# Altium project SC941C.PrjPcb (part 1 of 2)
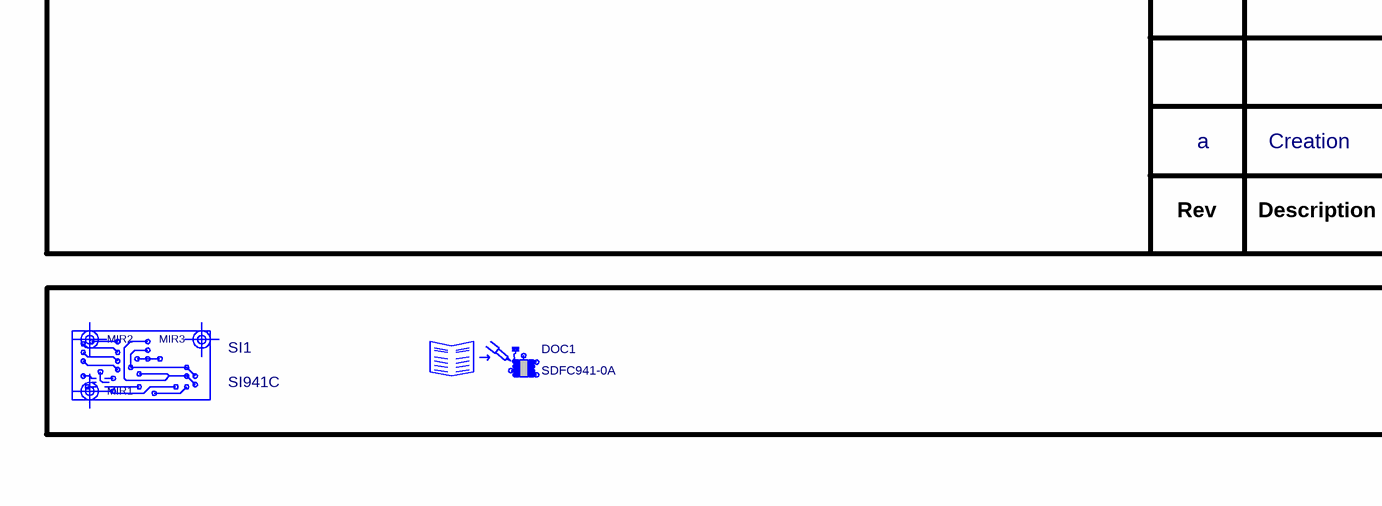
[diagram p0: SC941C_Sommaire.SchDoc, left]
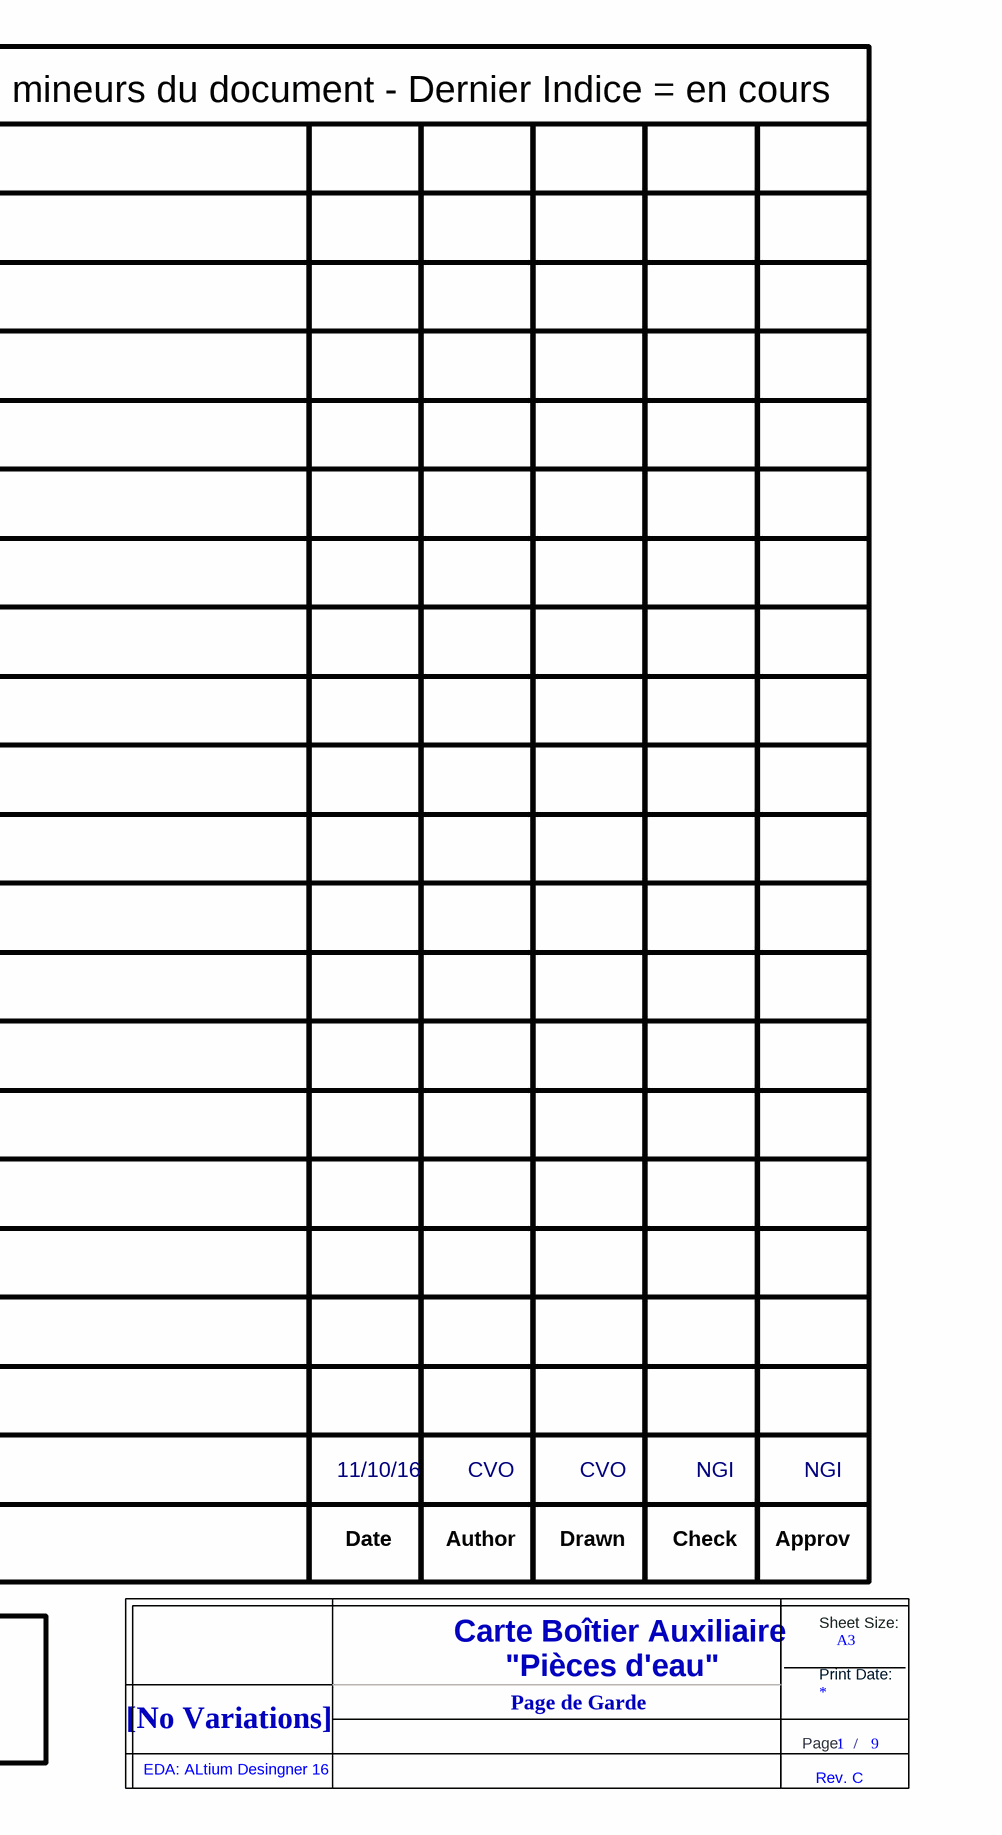
[diagram p1: SC941C_Sommaire.SchDoc, right]
_Instructions_SC: Les dates et versions mineurs du SDEC (SC) sont � remplir sur la page ..._infos.doc; _Instructions_SI: Les dates et versions mineurs du SI sont � remplir dans la couche "Cartouche TOP"; prjPcbTitle0: Carte Bo�tier Auxiliaire; prjPcbTitle1: "Pi�ces d'eau"; refSI1: SI941C; SDECSheetSize: A3; SISheetSize: A3
9 sheets, 334 parts. Net scope: global (net labels, ports and power ports of the same name join across sheets).
Board file: SI941C.PcbDoc
Sheets:
  SC941C_Sommaire.SchDoc
  SC941C_Coeur.SchDoc
  SC941C_ETOR1.SchDoc
  SC941C_ETOR2.SchDoc
  SC941C_STORRM1.SchDoc
  SC941C_STORRM2.SchDoc
  SC941C_Variateurs.SchDoc
  SC941C_STORRB.SchDoc
  SC941C_Borniers.SchDoc

## Sheet SC941C_Sommaire.SchDoc: Page de Garde
size 393 x 270 mm; CompanyName: Seccom; Address1: 521, rue du capt. François Garbit; Address2: 69440 Mornant; Address3: seccom@seccom.fr; Address4: www.seccom.fr; DocumentNumber: 1; SheetNumber: 1; SheetTotal: 9; PageSetup: Record=PageOptions|CenterHorizontal=True|CenterVertical=True|PrintScale=0.74|XCorrection=1.00|YCorrection=1.00|PrintKind=0|BorderSize=5000000|LeftOffset=0|BottomOffset=0|Orientation=2|PaperLength=1000|PaperWidth=1000|Scale=100|PaperSource=7|PrintQuality=-4|MediaType=1|DitherType=10|PaperKind=A4|PrintScaleMode=1

### Parts
(Parts that share a designator on the sheet are numbered #1, #2 ... from top to bottom, then left to right.)
DOC1  Reference: SDFC941-0A  (hidden comment: DOCUMENT_FAB_CARTE_SDFC)  (mechanical)
MIR1  MIRE_PICK-N-PLACE  [MIRE_PICK-N-PLACE_D1MM_VE3MM]  (value not drawn)
MIR2  MIRE_PICK-N-PLACE  [MIRE_PICK-N-PLACE_D1MM_VE3MM]  (value not drawn)
MIR3  MIRE_PICK-N-PLACE  [MIRE_PICK-N-PLACE_D1MM_VE3MM]  (value not drawn)
SI1  Reference: SI941C  [CIRCUIT_IMPRIME_SI_STD]
Title_new#1  DNI  (value not drawn)  (graphical)

### Notes on the sheet
- Historique des indices mineurs du document - Dernier Indice = en cours
- a
- Creation
- 11/10/16
- CVO
- NGI
- Rev
- Description
- Date
- Author
- Drawn
- Check
- Approv
- Page de Garde
- (in symbol Title_new) Sheet Size:; Carte Boîtier Auxiliaire; A3; "Pièces d'eau"; Print Date:; [No Variations]; Page:; /; EDA: ALtium Desingner 16; Rev. C

### Library data of the parts
DOC1 = DOCUMENT_FAB_CARTE_SDFC: Document de Fabrication pour la Carte SC{Num SC}-{Version SC}; Creation: LJ; Coeff: 0; Verification: *; Boitier: *; Fabricant: *; Ref Fab: *; Config: *; ComponentLink1URL: http://192.168.0.202/index.php/Accueil; ComponentLink2URL: http://192.168.0.202/index.php/Accueil; ComponentLink1Description: Datasheet; ComponentLink2Description: Datasheet Boitier
MIR1-MIR3 = MIRE_PICK-N-PLACE: Mire pour machine de placement CMS "Pick'n Place"; Creation: LJ (25/10/12); Config: NC; Coeff: 0; Value: *
SI1 = CIRCUIT_IMPRIME_MODEL: Circuit Imprimé; Creation: LJ; Verification: LJ (15/11/04); Remarque: {Remarque}; Fabricant: Valentinéa; Coeff: 1; Value: *; Boitier: *; Ref Fab: SI941C; ComponentLink1URL: \\SRV_backup\datasheet\; ComponentLink2URL: \\SRV_backup\datasheet\_BOITIERS\; Config: *; ComponentLink1Description: Datasheet; ComponentLink2Description: Datasheet Boitier
Title_new#1 = Title_new

## Sheet SC941C_Coeur.SchDoc: Coeur
size 393 x 270 mm; CompanyName: Seccom; Address1: 521, rue du capt. François Garbit; Address2: 69440 Mornant; Address3: seccom@seccom.fr; Address4: www.seccom.fr; DocumentNumber: 2; SheetNumber: 2; SheetTotal: 9; PageSetup: Record=PageOptions|CenterHorizontal=True|CenterVertical=True|PrintScale=0.74|XCorrection=1.00|YCorrection=1.00|PrintKind=0|BorderSize=5000000|LeftOffset=0|BottomOffset=0|Orientation=2|PaperLength=1000|PaperWidth=1000|Scale=100|PaperSource=7|PrintQuality=-4|MediaType=1|DitherType=10|PaperKind=A4|PrintScaleMode=1
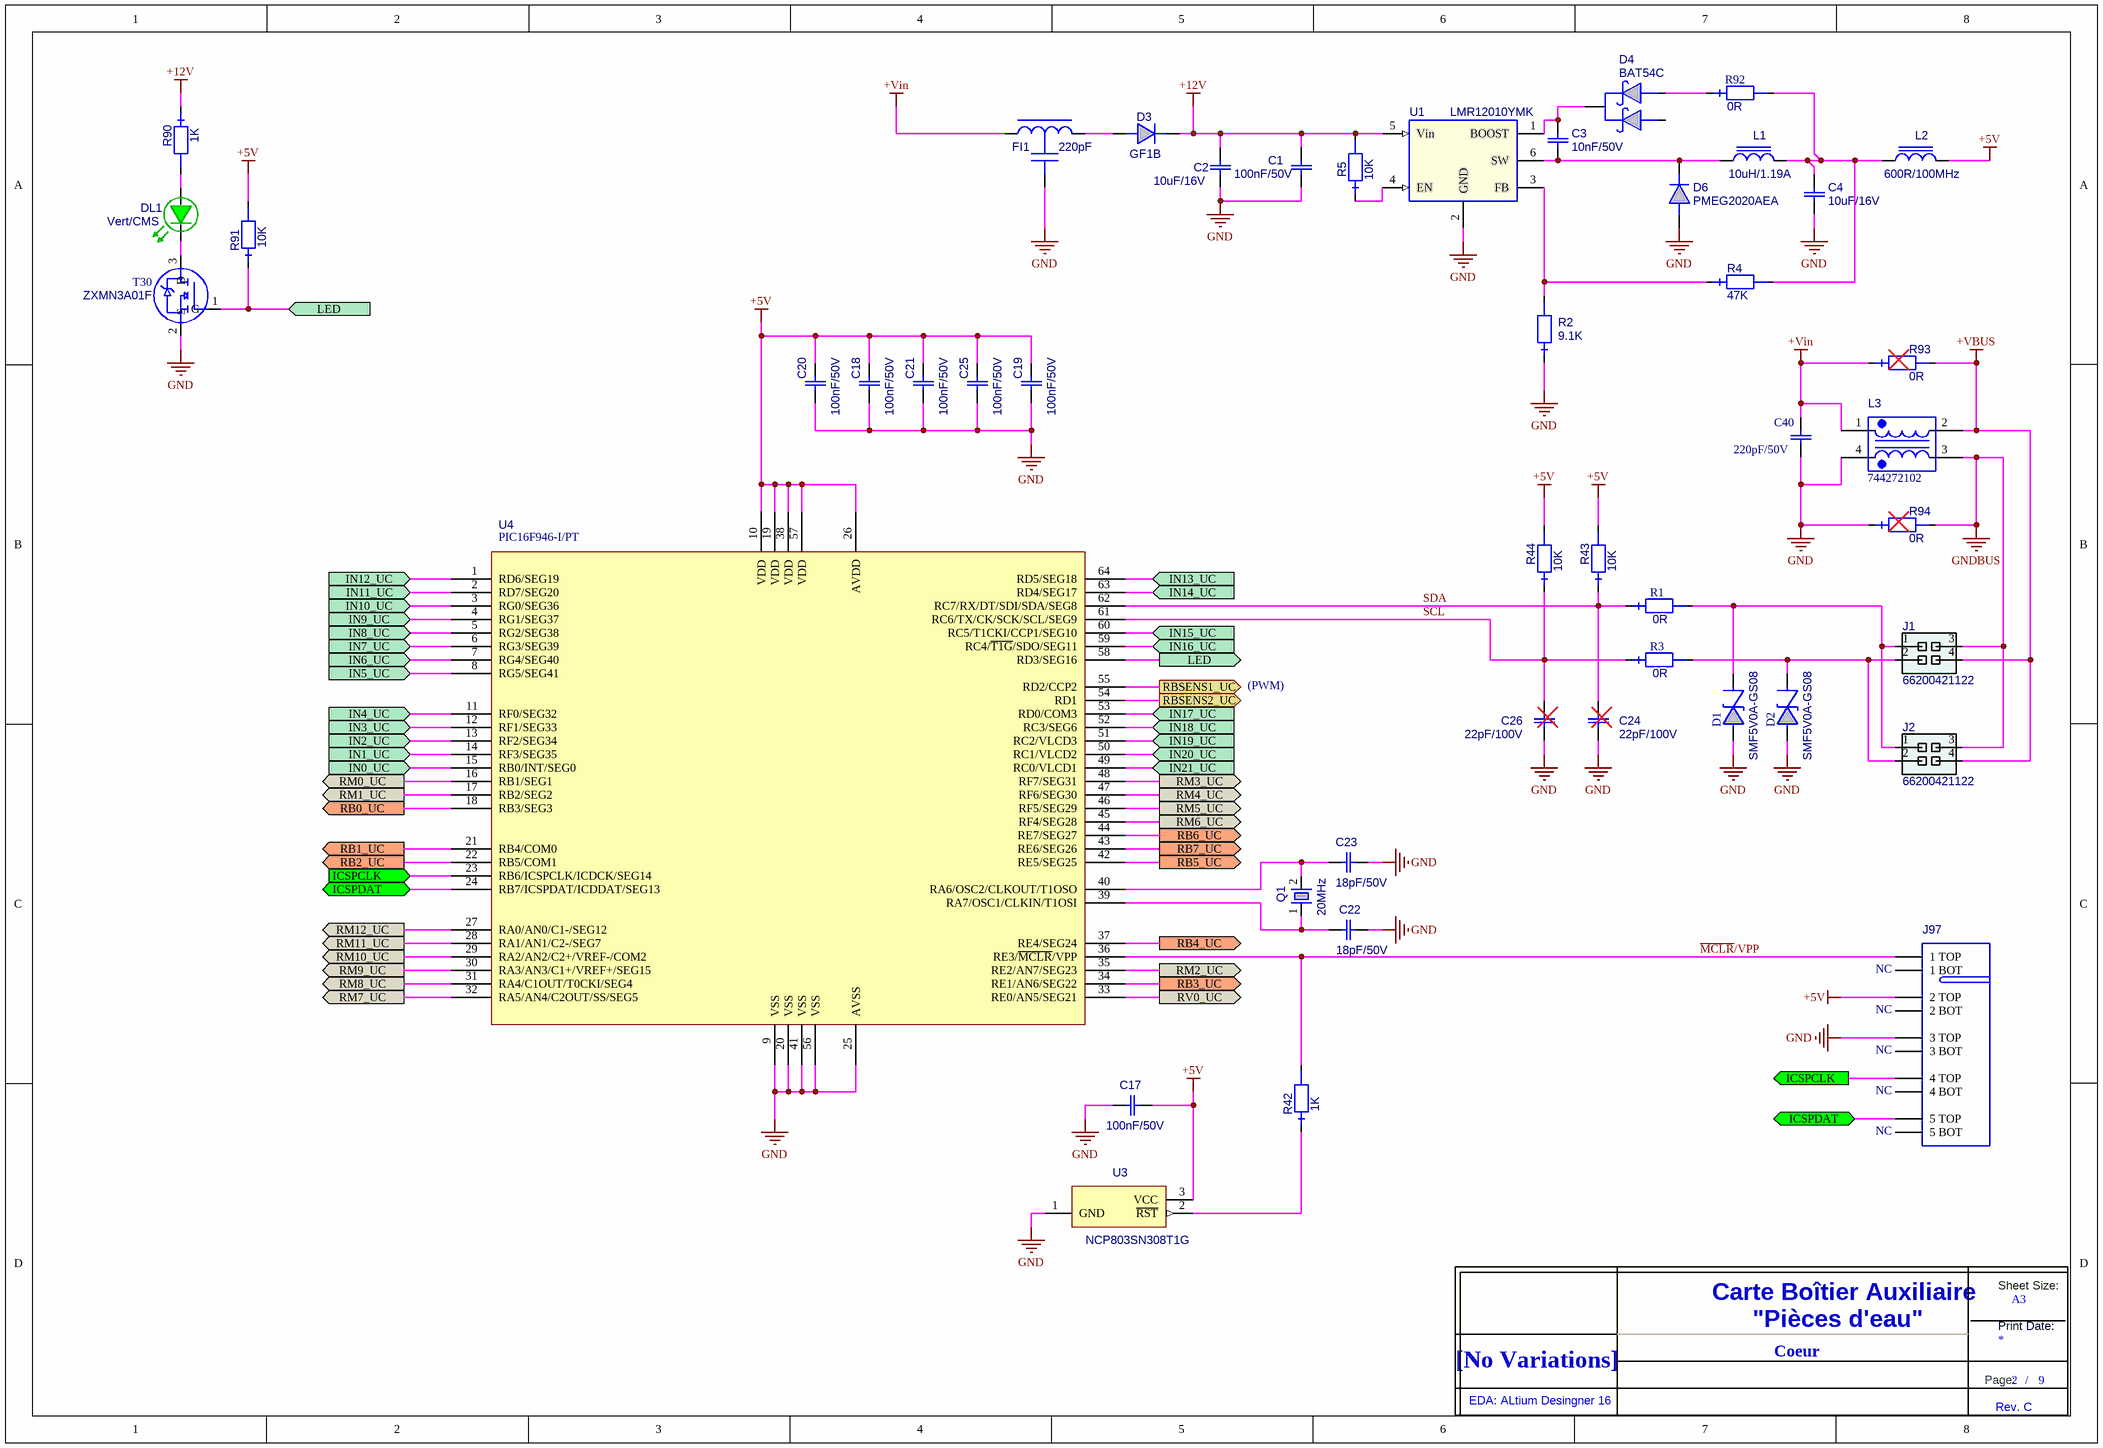
[diagram p2: SC941C_Coeur.SchDoc]

### Parts
(Parts that share a designator on the sheet are numbered #1, #2 ... from top to bottom, then left to right.)
C1  value 100nF/50V  [0805_ReflowSoldering_CAP]  (hidden comment: C_0805_X7R_10%_100N-50V)
C2  value 10uF/16V  [0805_ReflowSoldering_CAP]  (hidden comment: C_0805_X5R_10%_10U-16V)
C3  value 10nF/50V  [0603_ReflowSoldering_CAP]  (hidden comment: C_0603_X7R_10%_10N-50V)
C4  value 10uF/16V  [0805_ReflowSoldering_CAP]  (hidden comment: C_0805_X5R_10%_10U-16V)
C17  value 100nF/50V  [0805_ReflowSoldering_CAP]  (hidden comment: C_0805_X7R_10%_100N-50V)
C18  value 100nF/50V  [0805_ReflowSoldering_CAP]  (hidden comment: C_0805_X7R_10%_100N-50V)
C19  value 100nF/50V  [0805_ReflowSoldering_CAP]  (hidden comment: C_0805_X7R_10%_100N-50V)
C20  value 100nF/50V  [0805_ReflowSoldering_CAP]  (hidden comment: C_0805_X7R_10%_100N-50V)
C21  value 100nF/50V  [0805_ReflowSoldering_CAP]  (hidden comment: C_0805_X7R_10%_100N-50V)
C22  value 18pF/50V  [0603_ReflowSoldering_CAP]  (hidden comment: C_0603_NPO_5%_18P-50V)
C23  value 18pF/50V  [0603_ReflowSoldering_CAP]  (hidden comment: C_0603_NPO_5%_18P-50V)
C24  value 22pF/100V  [0805_ReflowSoldering_CAP]  (hidden comment: C_0805_NPO_5%_22P-100V)  (no BOM)
C25  value 100nF/50V  [0805_ReflowSoldering_CAP]  (hidden comment: C_0805_X7R_10%_100N-50V)
C26  value 22pF/100V  [0805_ReflowSoldering_CAP]  (hidden comment: C_0805_NPO_5%_22P-100V)  (no BOM)
C40  Capacitance: 220pF/50V  [0603_ReflowSoldering_CAP]  (hidden comment: C_0603_NPO_5%_220pF-50V)
D1  SMF5V0A-GS08  [DO219AB-SMF-P_ReflowSoldering]
D2  SMF5V0A-GS08  [DO219AB-SMF-P_ReflowSoldering]
D3  GF1B  [DO214BA-P]
D4  BAT54C  [SOT23_3L_ReflowSoldering]
D6  PMEG2020AEA  [SOD323_ReflowSoldering]
DL1  value Vert/CMS  [LED_0805_KPx_Green]  (hidden comment: LED_0805_VERT_KP2012)
FI1  value 220pF  [NFE31P]  (hidden comment: EMIFIL_220P_25V/6A_NFE31PT221D1E9L)
J1  value 66200421122  [MICRO-MATE-N-LOK_WURTH+TYCO_2X02_D]  (hidden comment: MICRO-MATE-N-LOK_WURTH_2X02_D)
J2  value 66200421122  [MICRO-MATE-N-LOK_WURTH+TYCO_2X02_D]  (hidden comment: MICRO-MATE-N-LOK_WURTH_2X02_D)
J97  EMB_ZEC_1893711_HOTE  [EMB_ZEC_1893711_HOTE_NOBOTT]  (value not drawn)  (no BOM)
L1  value 10uH/1.19A  [SELF_WE-TPC_4.8x4.78_(type4828)]  (hidden comment: SELF_10UH_1.19A_744043100)
L2  value 600R/100MHz  [1206_ReflowSoldering_FERRITE]  (hidden comment: IND_FERRITE_1206_74279218)
L3  744272102  [744272102]
Q1  value 20MHz  [QUARTZ_HC49_11.5X5_CMS]  (hidden comment: QUARTZ_HC49/4HSMX_20M)
R1  value 0R  [0805_ReflowSoldering_RES]  (hidden comment: RES_0805_1%_100PPM_0R)
R2  value 9.1K  [0805_ReflowSoldering_RES]  (hidden comment: RES_0805_1%_100PPM_9.1K)
R3  value 0R  [0805_ReflowSoldering_RES]  (hidden comment: RES_0805_1%_100PPM_0R)
R4  value 47K  [0805_ReflowSoldering_RES]  (hidden comment: RES_0805_1%_100PPM_47K)
R5  value 10K  [0805_ReflowSoldering_RES]  (hidden comment: RES_0805_1%_100PPM_10K)
R42  value 1K  [0805_ReflowSoldering_RES]  (hidden comment: RES_0805_1%_100PPM_1K)
R43  value 10K  [0805_ReflowSoldering_RES]  (hidden comment: RES_0805_1%_100PPM_10K)
R44  value 10K  [0805_ReflowSoldering_RES]  (hidden comment: RES_0805_1%_100PPM_10K)
R90  value 1K  [0805_ReflowSoldering_RES]  (hidden comment: RES_0805_1%_100PPM_1K)
R91  value 10K  [0805_ReflowSoldering_RES]  (hidden comment: RES_0805_1%_100PPM_10K)
R92  value 0R  [0805_ReflowSoldering_RES]  (hidden comment: RES_0805_1%_100PPM_0R)
R93  value 0R  [0603_ReflowSoldering_RES]  (hidden comment: RES_0603_1%_100PPM_0R)  (no BOM)
R94  value 0R  [0603_ReflowSoldering_RES]  (hidden comment: RES_0603_1%_100PPM_0R)  (no BOM)
T30  ZXMN3A01F  [SOT23_3L_ReflowSoldering]
Title_new#2  DNI  (value not drawn)  (graphical)
U1  LMR12010YMK  [SOT23_6L]
U3  NCP803SN308T1G  [SOT23_3L_ReflowSoldering]
U4  PIC16F946-I/PT  [QFP_064_E0,50_10X10MM]

### Ports
ICSPCLK (in), ICSPCLK (out), ICSPDAT (bidir), IN0_UC (in), IN1_UC (in), IN2_UC (in), IN3_UC (in), IN4_UC (in), IN5_UC (in), IN6_UC (in), IN7_UC (in), IN8_UC (in), IN9_UC (in), IN10_UC (in), IN11_UC (in), IN12_UC (in), IN13_UC (in), IN14_UC (in), IN15_UC (in), IN16_UC (in), IN17_UC (in), IN18_UC (in), IN19_UC (in), IN20_UC (in), IN21_UC (in), LED (in), LED (out), RB0_UC (out), RB1_UC (out), RB2_UC (out), RB3_UC (out), RB4_UC (out), RB5_UC (out), RB6_UC (out), RB7_UC (out), RBSENS1_UC (out), RBSENS2_UC (out), RM0_UC (out), RM1_UC (out), RM2_UC (out), RM3_UC (out), RM4_UC (out), RM5_UC (out), RM6_UC (out), RM7_UC (out), RM8_UC (out), RM9_UC (out), RM10_UC (out), RM11_UC (out), RM12_UC (out), RV0_UC (out)

### Nets
+5V: C17.1 C18.2 C19.2 C20.2 C21.2 C25.2 J97.2(2_TOP) L2.2 R43.2 R44.2 R91.2 U3.3(VCC) U4.10(VDD) U4.19(VDD) U4.26(AVDD) U4.38(VDD) U4.57(VDD)
+12V: C1.1 C2.2 D3.K R5.2 R90.1 U1.5(Vin)
+VBUS: J1.4 J2.4 L3.2 R93.2
+Vin: C40.2 FI1.1 L3.1 R93.1
GND: C1.2 C2.1 C4.1 C17.2 C18.1 C19.1 C20.1 C21.1 C22.1 C23.1 C24.1 C25.1 C26.1 C40.1 D1.A D2.A D6.A FI1.2 J97.3(3_TOP) L3.4 R2.1 R94.1 T30.2(S) U1.2(GND) U3.1(GND) U4.9(VSS) U4.20(VSS) U4.25(AVSS) U4.41(VSS) U4.56(VSS)
GNDBUS: J1.3 J2.3 L3.3 R94.2
~{MCLR}/VPP: J97.1(1_TOP) R42.2 U4.36(RE3/~{MCLR}/VPP)
ICSPCLK: J97.4(4_TOP) U4.23(RB6/ICSPCLK/ICDCK/SEG14) ; port ICSPCLK
ICSPDAT: J97.5(5_TOP) U4.24(RB7/ICSPDAT/ICDDAT/SEG13) ; port ICSPDAT
IN0_UC: U4.15(RB0/INT/SEG0) ; port IN0_UC
IN1_UC: U4.14(RF3/SEG35) ; port IN1_UC
IN2_UC: U4.13(RF2/SEG34) ; port IN2_UC
IN3_UC: U4.12(RF1/SEG33) ; port IN3_UC
IN4_UC: U4.11(RF0/SEG32) ; port IN4_UC
IN5_UC: U4.8(RG5/SEG41) ; port IN5_UC
IN6_UC: U4.7(RG4/SEG40) ; port IN6_UC
IN7_UC: U4.6(RG3/SEG39) ; port IN7_UC
IN8_UC: U4.5(RG2/SEG38) ; port IN8_UC
IN9_UC: U4.4(RG1/SEG37) ; port IN9_UC
IN10_UC: U4.3(RG0/SEG36) ; port IN10_UC
IN11_UC: U4.2(RD7/SEG20) ; port IN11_UC
IN12_UC: U4.1(RD6/SEG19) ; port IN12_UC
IN13_UC: U4.64(RD5/SEG18) ; port IN13_UC
IN14_UC: U4.63(RD4/SEG17) ; port IN14_UC
IN15_UC: U4.60(RC5/T1CKI/CCP1/SEG10) ; port IN15_UC
IN16_UC: U4.59(RC4/~{T1G}/SDO/SEG11) ; port IN16_UC
IN17_UC: U4.53(RD0/COM3) ; port IN17_UC
IN18_UC: U4.52(RC3/SEG6) ; port IN18_UC
IN19_UC: U4.51(RC2/VLCD3) ; port IN19_UC
IN20_UC: U4.50(RC1/VLCD2) ; port IN20_UC
IN21_UC: U4.49(RC0/VLCD1) ; port IN21_UC
LED: R91.1 T30.1(G) U4.58(RD3/SEG16) ; port LED
RB0_UC: U4.18(RB3/SEG3) ; port RB0_UC
RB1_UC: U4.21(RB4/COM0) ; port RB1_UC
RB2_UC: U4.22(RB5/COM1) ; port RB2_UC
RB3_UC: U4.34(RE1/AN6/SEG22) ; port RB3_UC
RB4_UC: U4.37(RE4/SEG24) ; port RB4_UC
RB5_UC: U4.42(RE5/SEG25) ; port RB5_UC
RB6_UC: U4.44(RE7/SEG27) ; port RB6_UC
RB7_UC: U4.43(RE6/SEG26) ; port RB7_UC
RBSENS1_UC: U4.55(RD2/CCP2) ; port RBSENS1_UC
RBSENS2_UC: U4.54(RD1) ; port RBSENS2_UC
RM0_UC: U4.16(RB1/SEG1) ; port RM0_UC
RM1_UC: U4.17(RB2/SEG2) ; port RM1_UC
RM2_UC: U4.35(RE2/AN7/SEG23) ; port RM2_UC
RM3_UC: U4.48(RF7/SEG31) ; port RM3_UC
RM4_UC: U4.47(RF6/SEG30) ; port RM4_UC
RM5_UC: U4.46(RF5/SEG29) ; port RM5_UC
RM6_UC: U4.45(RF4/SEG28) ; port RM6_UC
RM7_UC: U4.32(RA5/AN4/C2OUT/SS/SEG5) ; port RM7_UC
RM8_UC: U4.31(RA4/C1OUT/T0CKI/SEG4) ; port RM8_UC
RM9_UC: U4.30(RA3/AN3/C1+/VREF+/SEG15) ; port RM9_UC
RM10_UC: U4.29(RA2/AN2/C2+/VREF-/COM2) ; port RM10_UC
RM11_UC: U4.28(RA1/AN1/C2-/SEG7) ; port RM11_UC
RM12_UC: U4.27(RA0/AN0/C1-/SEG12) ; port RM12_UC
RV0_UC: U4.33(RE0/AN5/SEG21) ; port RV0_UC
SCL: C26.2 R3.1 R44.1 U4.61(RC6/TX/CK/SCK/SCL/SEG9)
SDA: C24.2 R1.1 R43.1 U4.62(RC7/RX/DT/SDI/SDA/SEG8)
NetC3_1: C3.1 D6.K L1.1 U1.6(SW)
NetC3_2: C3.2 D4.3 U1.1(BOOST)
NetC4_2: C4.2 L1.2 L2.1 R4.2 R92.2
NetC22_2: C22.2 Q1.1 U4.39(RA7/OSC1/CLKIN/T1OSI)
NetC23_2: C23.2 Q1.2 U4.40(RA6/OSC2/CLKOUT/T1OSO)
NetD1_K: D1.K J1.1 J2.1 R1.2
NetD2_K: D2.K J1.2 J2.2 R3.2
NetD3_A: D3.A FI1.3
NetD4_1: D4.1 R92.1
NetDL1_A: DL1.A R90.2
NetDL1_K: DL1.K T30.3(D)
NetR2_2: R2.2 R4.1 U1.3(FB)
NetR5_1: R5.1 U1.4(EN)
NetR42_1: R42.1 U3.2(~{RST})

Not connected (* = marked no-connect by the designer): D4 2; J97 6(1_BOT) 7(2_BOT) 8(3_BOT) 9(4_BOT) 10(5_BOT); L1 3 4 5 6

### Notes on the sheet
- (PWM)
- (near J97) NC
- Coeur
- (in symbol Title_new) Sheet Size:; Carte Boîtier Auxiliaire; A3; "Pièces d'eau"; Print Date:; [No Variations]; Page:; /; EDA: ALtium Desingner 16; Rev. C

### Library data of the parts
C1 C17-C21 C25 = C_0805_X7R_10%_100N-50V: Condensateur céramique, X7R, 10%, CMS 0805; Creation: LJ; Verification: LJ (28/05/04); Reference: 000042/00; Boitier: 0805; Remarque: {Remarque}; Fabricant: AVX; Ref Fab: 08055C104KAT2A; Coeff: 1; ComponentLink1URL: o:\_Documentation\Datasheets\BC_Components\Condo_CMS_NPO-X7R-Y5V.pdf; ComponentLink2URL: o:\_Documentation\Datasheets\_BOITIERS\PASSIF_CMS\RC_0805_(2x1,25)_(Schneider).PDF; Config: *; ComponentLink1Description: Datasheet; ComponentLink2Description: Datasheet Boitier; Supplier 1: Farnell; Supplier Part Number 1: 499687
C2 C4 = C_0805_X5R_10%_10U-16V: Condensateur céramique, X5R, 10%, CMS 0805; Creation: LJ (12/09/11); Reference: 001715/00; Boitier: 0805; Remarque: {Remarque}; Coeff: 1; Fabricant: Murata; Ref Fab: GRM219R61C106KA73D; Verification: *; ComponentLink1URL: o:\_Documentation\Datasheets\; ComponentLink2URL: o:\_Documentation\Datasheets\_Boitiers\PASSIF_CMS\RC_0805_(2x1,25)_(Schneider).pdf; Config: *; ComponentLink1Description: Datasheet; ComponentLink2Description: Datasheet Boitier
C3 = C_0603_X7R_10%_10N-50V: Condensateur céramique, X7R, 10%, CMS 0603; Creation: CHD; Boitier: 0603; Remarque: {Remarque}; Coeff: 1; Fabricant: Kemet; Ref Fab: C0603C103K5RAC; ComponentLink1URL: o:\_Documentation\Datasheets\Kemet\Condos_Ceramic_CMS.pdf; ComponentLink2URL: o:\_Documentation\Datasheets\_BOITIERS\PASSIF_CMS\; Config: *; ComponentLink1Description: Datasheet; ComponentLink2Description: Datasheet Boitier; Supplier 1: Farnell; Supplier Part Number 1: 1414609
C22 C23 = C_0603_NPO_5%_18P-50V: Condensateur céramique, NPO, 5%, CMS 0603, 18pF/50V; Creation: FB (04/07/12); Boitier: 0603; Remarque: {Remarque}; Fabricant: Kemet; Ref Fab: C0603C180J5GAC; Coeff: 1; ComponentLink2URL: o:\_Documentation\Datasheets\_BOITIERS\PASSIF_CMS\; Config: *; ComponentLink1Description: Datasheet; ComponentLink2Description: Datasheet Boitier; Supplier 1: Farnell; Supplier Part Number 1: 1414620
C24 C26 = C_0805_NPO_5%_22P-100V: Condensateur céramique, NPO, 5%, CMS 0805; Creation: LJ; Verification: LJ (28/05/04); Boitier: 0805; Remarque: {Remarque}; Fabricant: AVX; Ref Fab: 08051A220JAT2A; Coeff: 1; ComponentLink1URL: o:\_Documentation\Datasheets\BC_Components\Condo_CMS_NPO-X7R-Y5V.pdf; ComponentLink2URL: o:\_Documentation\Datasheets\_BOITIERS\PASSIF_CMS\RC_0805_(2x1,25)_(Schneider).PDF; Config: *; ComponentLink1Description: Datasheet; ComponentLink2Description: Datasheet Boitier; Supplier 1: Farnell; Supplier 2: Mouser; Supplier Part Number 1: 317500; Supplier Part Number 2: 581-08051A220J
C40 = C_0603_NPO_5%_220pF-50V: Multilayer Ceramic Capacitors MLCC - SMD/SMT 50volts 220pF C0G 5%; Manufacturer: Kemet; Manufacturer Part Number: C0603C221J5GACTU; Temperature Coefficient: C0G, NP0; Ref Fab: C0603C221J5GAC; Value: 220pF/50V; Value: 220pF/50V; Supplier 1: Digi-Key; RoHS: RoHS Compliant; Category: Capacitors; Stock 1: 173034; Pricing 1: 1=0.1, 10=0.042, 50=0.0228, 100=0.0193, 250=0.01576, 500=0.01348, 1000=0.0105 (USD); Packaging: Cut Tape (CT); Part Status: Active; Tolerance: ±5%; Operating Temperature: -55°C ~ 125°C; Features: Low ESL; Ratings: -; Applications: General Purpose; Failure Rate: -; Mounting Type: Surface Mount, MLCC; Package / Case: 0603 (1608 Metric); Size / Dimension: 0.063" L x 0.031" W (1.60mm x 0.80mm); Height - Seated (Max): -; Thickness (Max): 0.034" (0.87mm); Lead Spacing: -; Lead Style: -; ComponentLink1URL: http://www.kemet.com/docfinder?Partnumber=C0603C221J5GACTU; ComponentLink1Description: http://www.kemet.com/docfinder?Partnumber=C0603C221J5GACTU; Supplier Part Number 1: 399-1066-1-ND; Fabricant: Kemet
D1 D2 = SMF5V0A-GS08: Diode Transil/TVS unidirectionnelle (A), 200W, 5V, CMS; Creation: LJ; Boitier: DO219AB/SMF; Remarque: {Remarque}; Fabricant: Vishay; Coeff: 1; Verification: *; Ref Fab: SMF5V0A-GS08; ComponentLink1URL: o:\_Documentation\Datasheets\Vishay\SMF5V0A~51A.pdf; ComponentLink2URL: o:\_Documentation\Datasheets\_BOITIERS\; Config: *; ComponentLink1Description: Datasheet; ComponentLink2Description: Datasheet Boitier; Value: SMF5V0A-GS08; Supplier 1: Farnell; Supplier 2: Mouser; Supplier Part Number 1: 1617696; Supplier Part Number 2: 78-SMF5V0A
D3 = GF1B: Diode de Redressement, Vrrm=100V, If=1A, Vf=1.1V, CMS; Creation: LJ; Reference: 000919/00; Boitier: DO214BA; Fabricant: Fairchild; Coeff: 1; Ref Fab: GF1B; ComponentLink1URL: o:\_Documentation\Datasheets\Fairchild\GF1A-M.PDF; ComponentLink2URL: o:\_Documentation\Datasheets\_BOITIERS\ACTIF_CMS\; Config: *; ComponentLink1Description: Datasheet; ComponentLink2Description: Datasheet Boitier; Value: GF1B; Supplier 1: Farnell; Supplier 2: Mouser; Supplier Part Number 1: 1467477; Supplier Part Number 2: 512-GF1B
D4 = BAT54C: Diode Schottky double, BAT54 cathode com, Vrrm=30V, If=300mA, Vf=0.4Vmax, CMS; Creation: LJ (14/05/02); Reference: 000597/00; Boitier: SOT23_3L; Remarque: {Remarque}; Fabricant: NXP; Coeff: 1; Verification: LJ (14/05/02); Ref Fab: BAT54C; ComponentLink1URL: o:\_Documentation\Datasheets\NXP\BAT54_series.pdf; ComponentLink2URL: o:\_Documentation\Datasheets\_BOITIERS\ACTIF_CMS\SOT\SOT_23_3P_(Schneider).PDF; Config: *; ComponentLink1Description: Datasheet; ComponentLink2Description: Datasheet Boitier; Value: BAT54C; Supplier 1: Farnell; Supplier Part Number 1: 1081192
D6 = PMEG2020AEA: Diode Schottky, Vrrm=20V, If=2A, Vf=450V, CMS; Creation: PDP 10/07/12; Verification: LJ (02/08/12); Boitier: SOD323; Remarque: {Remarque}; Coeff: 1; Fabricant: NXP; ComponentLink1URL: o:\_Documentation\Datasheets\NXP\PMEG2020AEA.PDF; ComponentLink2URL: o:\_Documentation\Datasheets\_BOITIERS\ACTIF_CMS\SOD\SOD_80_(MLL34)_(Schneider).PDF; Config: *; ComponentLink1Description: Datasheet; ComponentLink2Description: Datasheet Boitier; Ref Fab: PMEG2020AEA; Value: PMEG2020AEA; Supplier 1: Farnell; Supplier Part Number 1: 8737940; Supplier 2: Mouser; Supplier Part Number 2: 771-PMEG2020AEA-T/R
DL1 = LED_0805_VERT_KP2012: LED CMS 0805, Vert, Vf 2.5V@20mA (4-15mCd), 525nm, vue 120°; Creation: LJ (12/01/09); Reference: 000037/00; Boitier: 0805; Remarque: {Remarque}; Fabricant: Kingbright; Ref Fab: KP-2012SGC; Coeff: 1; Verification: *; ComponentLink1URL: o:\_Documentation\Datasheets\Kingbright\Leds_0805_Green_KP-2012SGC.pdf; ComponentLink2URL: o:\_Documentation\Datasheets\Kingbright\Leds_0805_Green_KP-2012SGC.pdf; Config: *; ComponentLink1Description: Datasheet; ComponentLink2Description: Datasheet Boitier; Supplier 1: Farnell; Supplier Part Number 1: 1318243
FI1 = EMIFIL_220P_25V/6A_NFE31PT221D1E9L: Filtre EMI selfique-capacitif, -20/+50%, 25Vcc/6A, -40/+85°C, 220pF; Creation: LJ; Boitier: 1206; Remarque: Anciennement série NFM60R...; Reference: 000785/00; Fabricant: Murata; Coeff: 1; Verification: *; Ref Fab: NFE31PT221D1E9L; ComponentLink1URL: o:\_Documentation\Datasheets\Murata\EMIFIL_NFE31P.pdf; ComponentLink2URL: o:\_Documentation\Datasheets\_BOITIERS\; Config: *; ComponentLink1Description: Datasheet; ComponentLink2Description: Datasheet Boitier
J1 J2 = MICRO-MATE-N-LOK_WURTH_2X02_D: Embase type Micro Mate-n-Lok, e3mm, 4pts, droit, cont. étamés 20mR, 250V/5A, Iso 1500V, -40/+105°C; Creation: LJ (01/08/12); Boitier: Micro Mate-n-Lok 4 D; Remarque: {Remarque}; Fabricant: Wurth Elektronik; Coeff: 1; Ref Fab: 66200421122; ComponentLink1URL: o:\_Documentation\Datasheets\; ComponentLink2URL: o:\_Documentation\Datasheets\; Config: *; ComponentLink1Description: Datasheet; ComponentLink2Description: Datasheet Boitier
J97 = EMB_ZEC_1893711_HOTE: Implantation CI pour connecteur ZEC 1,0/5-ST-3,5 C1 R1,5 (ref 1893711); Creation: JPL (18/07/12); Fabricant: Phoenix Contact; Coeff: 1; Config: *; ComponentLink1Description: Datasheet; ComponentLink2Description: Datasheet Boitier
L1 = SELF_10UH_1.19A_744043100: Inductance bobinée CMS, 10uH +/- 10%, I=1.19A, Rdc=0.095R, SRF=40MHz, -40/+85°C; Creation: LJ (02/08/12); Boitier: 4.8x4.8_h2.8mm; Coeff: 1; Fabricant: Wurth Elektronik; Verification: *; ComponentLink1URL: O:\_Documentation\Datasheets\Wurth_Elektronik\744043100.pdf; ComponentLink2URL: O:\_Documentation\Datasheets\Wurth_Elektronik\744043100.pdf; Remarque: *; Config: *; ComponentLink1Description: Datasheet; ComponentLink2Description: Datasheet Boitier; Ref Fab: 744043100
L2 = IND_FERRITE_1206_74279218: Inductance à ferrite multicouches CMS, imp=600R@100MHz, +/-25%, Rdc=100mR, I=2A; Creation: LJ (12/08/08); Reference: 000049/00; Boitier: 1206; Remarque: Alternative aux selfs de choc; Coeff: 1; Fabricant: Wurth Elektronik; Verification: *; ComponentLink1URL: o:\_Documentation\Datasheets\Wurth_Elektronik\74279218.pdf; ComponentLink2URL: o:\_Documentation\Datasheets\_Boitiers\PASSIF_CMS\RC_1206_(3,2x1,6)_(Schneider).pdf; Config: *; ComponentLink1Description: Datasheet; ComponentLink2Description: Datasheet Boitier; Ref Fab: 74279218
L3 = IND_FERRITE_WE-SL5_2X1000UH: Common Mode Filters / Chokes WE-SL5 Bifilar 2x1000uH 950mA; Manufacturer: Wurth Electronics Inc; Filter Type: Signal Line; Number of Lines: 2; Impedance @ Frequency: 3.6 kOhm @ 100kHz; Inductance @ Frequency: 1mH @ 100kHz; DC Resistance (DCR) (Max): 180 mOhm; Voltage Rating - DC: 80V; Fabricant: Wurth Elektronik; Supplier 1: Digi-Key; Manufacturer Part Number: 744272102; RoHS: RoHS Compliant; Category: Filters; Stock 1: 4893; Pricing 1: 1=3.57, 10=3.255, 50=2.94, 100=2.835 (USD); Packaging: Cut Tape (CT); Part Status: Active; Current Rating (Max): 950mA; Voltage Rating - AC: -; Operating Temperature: -40°C ~ 125°C; Ratings: -; Approvals: -; Features: -; Mounting Type: Surface Mount; Size / Dimension: 0.394" L x 0.343" W (10.00mm x 8.70mm); Height (Max): 0.256" (6.50mm); Package / Case: Horizontal, 4 PC Pad; ComponentLink1URL: http://katalog.we-online.de/pbs/datasheet/744272102.pdf; ComponentLink1Description: http://katalog.we-online.de/pbs/datasheet/744272102.pdf; Supplier Part Number 1: 732-1493-1-ND; Ref Fab: 744272102; Value: 744272102
Q1 = QUARTZ_HC49/4HSMX_20M: Quartz CMS série HCM49 (équiv HC49/US), -10/+60°C, +/-30ppm, 18pF; Creation: FB (04/09/12); Fabricant: Citizen; Ref Fab: HCM49 20.000MABJ-UT; Coeff: 1; Verification: *; Boitier: HC49/4HSMX; Remarque: *; ComponentLink1URL: O:\_Documentation\Datasheets\Citizen\Quartz_HC49-US_HCM49.pdf; ComponentLink2URL: o:\_Documentation\Datasheets\_BOITIERS\; Config: *; ComponentLink1Description: Datasheet; ComponentLink2Description: Datasheet Boitier; Supplier 1: Farnell; Supplier Part Number 1: 1611736; Supplier 2: Mouser; Supplier Part Number 2: 695-HCM49-20-U
R1 R3 R92 = RES_0805_1%_100PPM_0R: Résistance CMS 0805, 0.125W, 1%, 100ppm, 150V; Creation: LJ (06/02/09); Reference: 000052/00; Boitier: 0805; Remarque: {Remarque}; Fabricant: Welwyn; Ref Fab: WCR0805-R005JI; Coeff: 1; Verification: *; ComponentLink1URL: o:\_Documentation\Datasheets\Welwyn\Resistances_CMS_General.pdf; ComponentLink2URL: o:\_Documentation\Datasheets\_BOITIERS\PASSIF_CMS\RC_0805_(2x1,25)_(Schneider).PDF; Config: *; ComponentLink1Description: Datasheet; ComponentLink2Description: Datasheet Boitier; Supplier 1: Farnell; Supplier Part Number 1: 1099786
R2 = RES_0805_1%_100PPM_9.1K: Résistance CMS 0805, 0.125W, 1%, 100ppm, 150V; Creation: LJ (06/02/09); Reference: 000144/00; Boitier: 0805; Remarque: {Remarque}; Coeff: 1; Fabricant: Yageo; Ref Fab: RC0805FR-079K1L; Verification: *; ComponentLink1URL: o:\_Documentation\Datasheets\BC_Components\Resistances_ThickFilmFlatChip_0402-0603-0805-1206.pdf; ComponentLink2URL: o:\_Documentation\Datasheets\_BOITIERS\PASSIF_CMS\RC_0805_(2x1,25)_(Schneider).PDF; Config: *; ComponentLink1Description: Datasheet; ComponentLink2Description: Datasheet Boitier; Supplier 1: Mouser; Supplier Part Number 1: 603-RC0805FR-079K1L
R4 = RES_0805_1%_100PPM_47K: Résistance CMS 0805, 0.125W, 1%, 100ppm, 150V; Creation: LJ (06/02/09); Reference: 000141/00; Boitier: 0805; Remarque: {Remarque}; Coeff: 1; Fabricant: Yageo; Ref Fab: C0805FR-0747KL; Verification: *; ComponentLink1URL: o:\_Documentation\Datasheets\BC_Components\Resistances_ThickFilmFlatChip_0402-0603-0805-1206.pdf; ComponentLink2URL: o:\_Documentation\Datasheets\_BOITIERS\PASSIF_CMS\RC_0805_(2x1,25)_(Schneider).PDF; Config: *; ComponentLink1Description: Datasheet; ComponentLink2Description: Datasheet Boitier
R5 R43 R44 R91 = RES_0805_1%_100PPM_10K: Résistance CMS 0805, 0.125W, 1%, 100ppm, 150V; Creation: LJ (06/02/09); Reference: 000063/00; Boitier: 0805; Remarque: {Remarque}; Fabricant: Yageo; Ref Fab: RC0805FR-0710KL; Coeff: 1; Verification: *; ComponentLink1URL: o:\_Documentation\Datasheets\BC_Components\Resistances_ThickFilmFlatChip_0402-0603-0805-1206.pdf; ComponentLink2URL: o:\_Documentation\Datasheets\_BOITIERS\PASSIF_CMS\RC_0805_(2x1,25)_(Schneider).PDF; Config: *; ComponentLink1Description: Datasheet; ComponentLink2Description: Datasheet Boitier; Supplier 1: Farnell; Supplier Part Number 1: 9237755
R42 R90 = RES_0805_1%_100PPM_1K: Résistance CMS 0805, 0.125W, 1%, 100ppm, 150V; Creation: LJ (06/02/09); Reference: 000059/00; Boitier: 0805; Remarque: {Remarque}; Fabricant: Vishay; Ref Fab: CRCW08051K00FKEA; Coeff: 1; Verification: *; ComponentLink1URL: o:\_Documentation\Datasheets\BC_Components\Resistances_ThickFilmFlatChip_0402-0603-0805-1206.pdf; ComponentLink2URL: o:\_Documentation\Datasheets\_BOITIERS\PASSIF_CMS\RC_0805_(2x1,25)_(Schneider).PDF; Config: *; ComponentLink1Description: Datasheet; ComponentLink2Description: Datasheet Boitier; Supplier 1: Farnell; Supplier 2: Mouser; Supplier Part Number 1: 1469847; Supplier Part Number 2: 71-CRCW0805-1.0K-E3
R93 R94 = RES_0603_1%_100PPM_0R: Résistance, 0.100W, 1%, 100ppm, 75V, 0R; Creation: FB (04/07/12); Boitier: 0603; Remarque: {Remarque}; Fabricant: Vishay; Ref Fab: CRCW06030000Z0EA; Coeff: 1; Verification: *; ComponentLink1URL: O:\_Documentation\Datasheets\Vishay\Resistances_D-CRCWe3.pdf; ComponentLink2URL: o:\_Documentation\Datasheets\_BOITIERS\PASSIF_CMS\; Config: *; ComponentLink1Description: Datasheet; ComponentLink2Description: Datasheet Boitier; Supplier 1: Farnell; Supplier Part Number 1: 1469739
T30 = ZXMN3A01F: Transistor MOSN logique, Vdss=30V, Id=2A, Rdson=0.12R, CMS; Boitier: SOT23_3L; Remarque: {Remarque}; Creation: CHD; Fabricant: Zetex; Coeff: 1; Ref Fab: ZXMN3A01F; ComponentLink1URL: o:\_Documentation\Datasheets\; ComponentLink2URL: o:\_Documentation\Datasheets\_BOITIERS\ACTIF_CMS\SOT\SOT_23_3P_(Schneider).PDF; Config: *; ComponentLink1Description: Datasheet; Value: ZXMN3A01F; Supplier 1: Farnell; Supplier 2: Mouser; Supplier Part Number 1: 9525734; Supplier Part Number 2: 522-ZXMN3A01FTA
Title_new#2 = Title_new
U1 = LMR12010YMK: Régulateur ajustable step down, 0.8~20V, 1A, Vin=3~20V, -40/+125°C, CMS; Creation: PDP (10/07/12); Verification: LJ (02/08/12); Boitier: TSOT-6; Remarque: {Remarque}; Coeff: 1; Fabricant: National Semiconductor; ComponentLink1URL: O:\_Documentation\Datasheets\National_SemiConductors\LMR12010.pdf; ComponentLink2URL: o:\_Documentation\Datasheets\_Boitiers\ACTIF_CMS\; ComponentLink1Description: Datasheet; ComponentLink2Description: Datasheet Boitier; Ref Fab: LMR12010YMK; Value: LMR12010YMK; Supplier 1: Farnell; Supplier Part Number 1: 2060645; Supplier 2: Mouser; Supplier Part Number 2: 926-LMR12010YMKENOPB
U3 = NCP803SN308T1G: Superviseur de Reset pour microcontrolleur 3.08V -Pin SOT-23, CMS; Boitier: SOT23_3L; Remarque: {Remarque}; Creation: CHD; Fabricant: ON; Coeff: 1; Ref Fab: NCP803SN308T1G; ComponentLink1URL: o:\_Documentation\Datasheets\; ComponentLink2URL: o:\_Documentation\Datasheets\_BOITIERS\ACTIF_CMS\SOT\SOT_23_3P_(Schneider).PDF; Config: *; ComponentLink1Description: Datasheet; Value: NCP803SN308T1G
U4 = PIC16F946-I/PT: Microcontrôleur 8bit; Creation: CHD; Boitier: QFP64_e0.50_12x12mm; Remarque: {Remarque}; Fabricant: Microchip; Coeff: 1; Ref Fab: PIC16F946-I/PT; ComponentLink1URL: o:\_Documentation\Datasheets\MicroChip\PIC16F913_914_916_917_946.pdf; ComponentLink2URL: o:\_Documentation\Datasheets\_Boitiers\; Config: *; ComponentLink1Description: Datasheet; ComponentLink2Description: Datasheet Boitier; Value: PIC16F946-I/PT

## Sheet SC941C_ETOR1.SchDoc: Entrées TOR 1/2
size 393 x 270 mm; CompanyName: Seccom; Address1: 521, rue du capt. François Garbit; Address2: 69440 Mornant; Address3: seccom@seccom.fr; Address4: www.seccom.fr; DocumentNumber: 3; SheetNumber: 3; SheetTotal: 9; PageSetup: Record=PageOptions|CenterHorizontal=True|CenterVertical=True|PrintScale=0.74|XCorrection=1.00|YCorrection=1.00|PrintKind=0|BorderSize=5000000|LeftOffset=0|BottomOffset=0|Orientation=2|PaperLength=1000|PaperWidth=1000|Scale=100|PaperSource=7|PrintQuality=-4|MediaType=1|DitherType=10|PaperKind=A4|PrintScaleMode=1
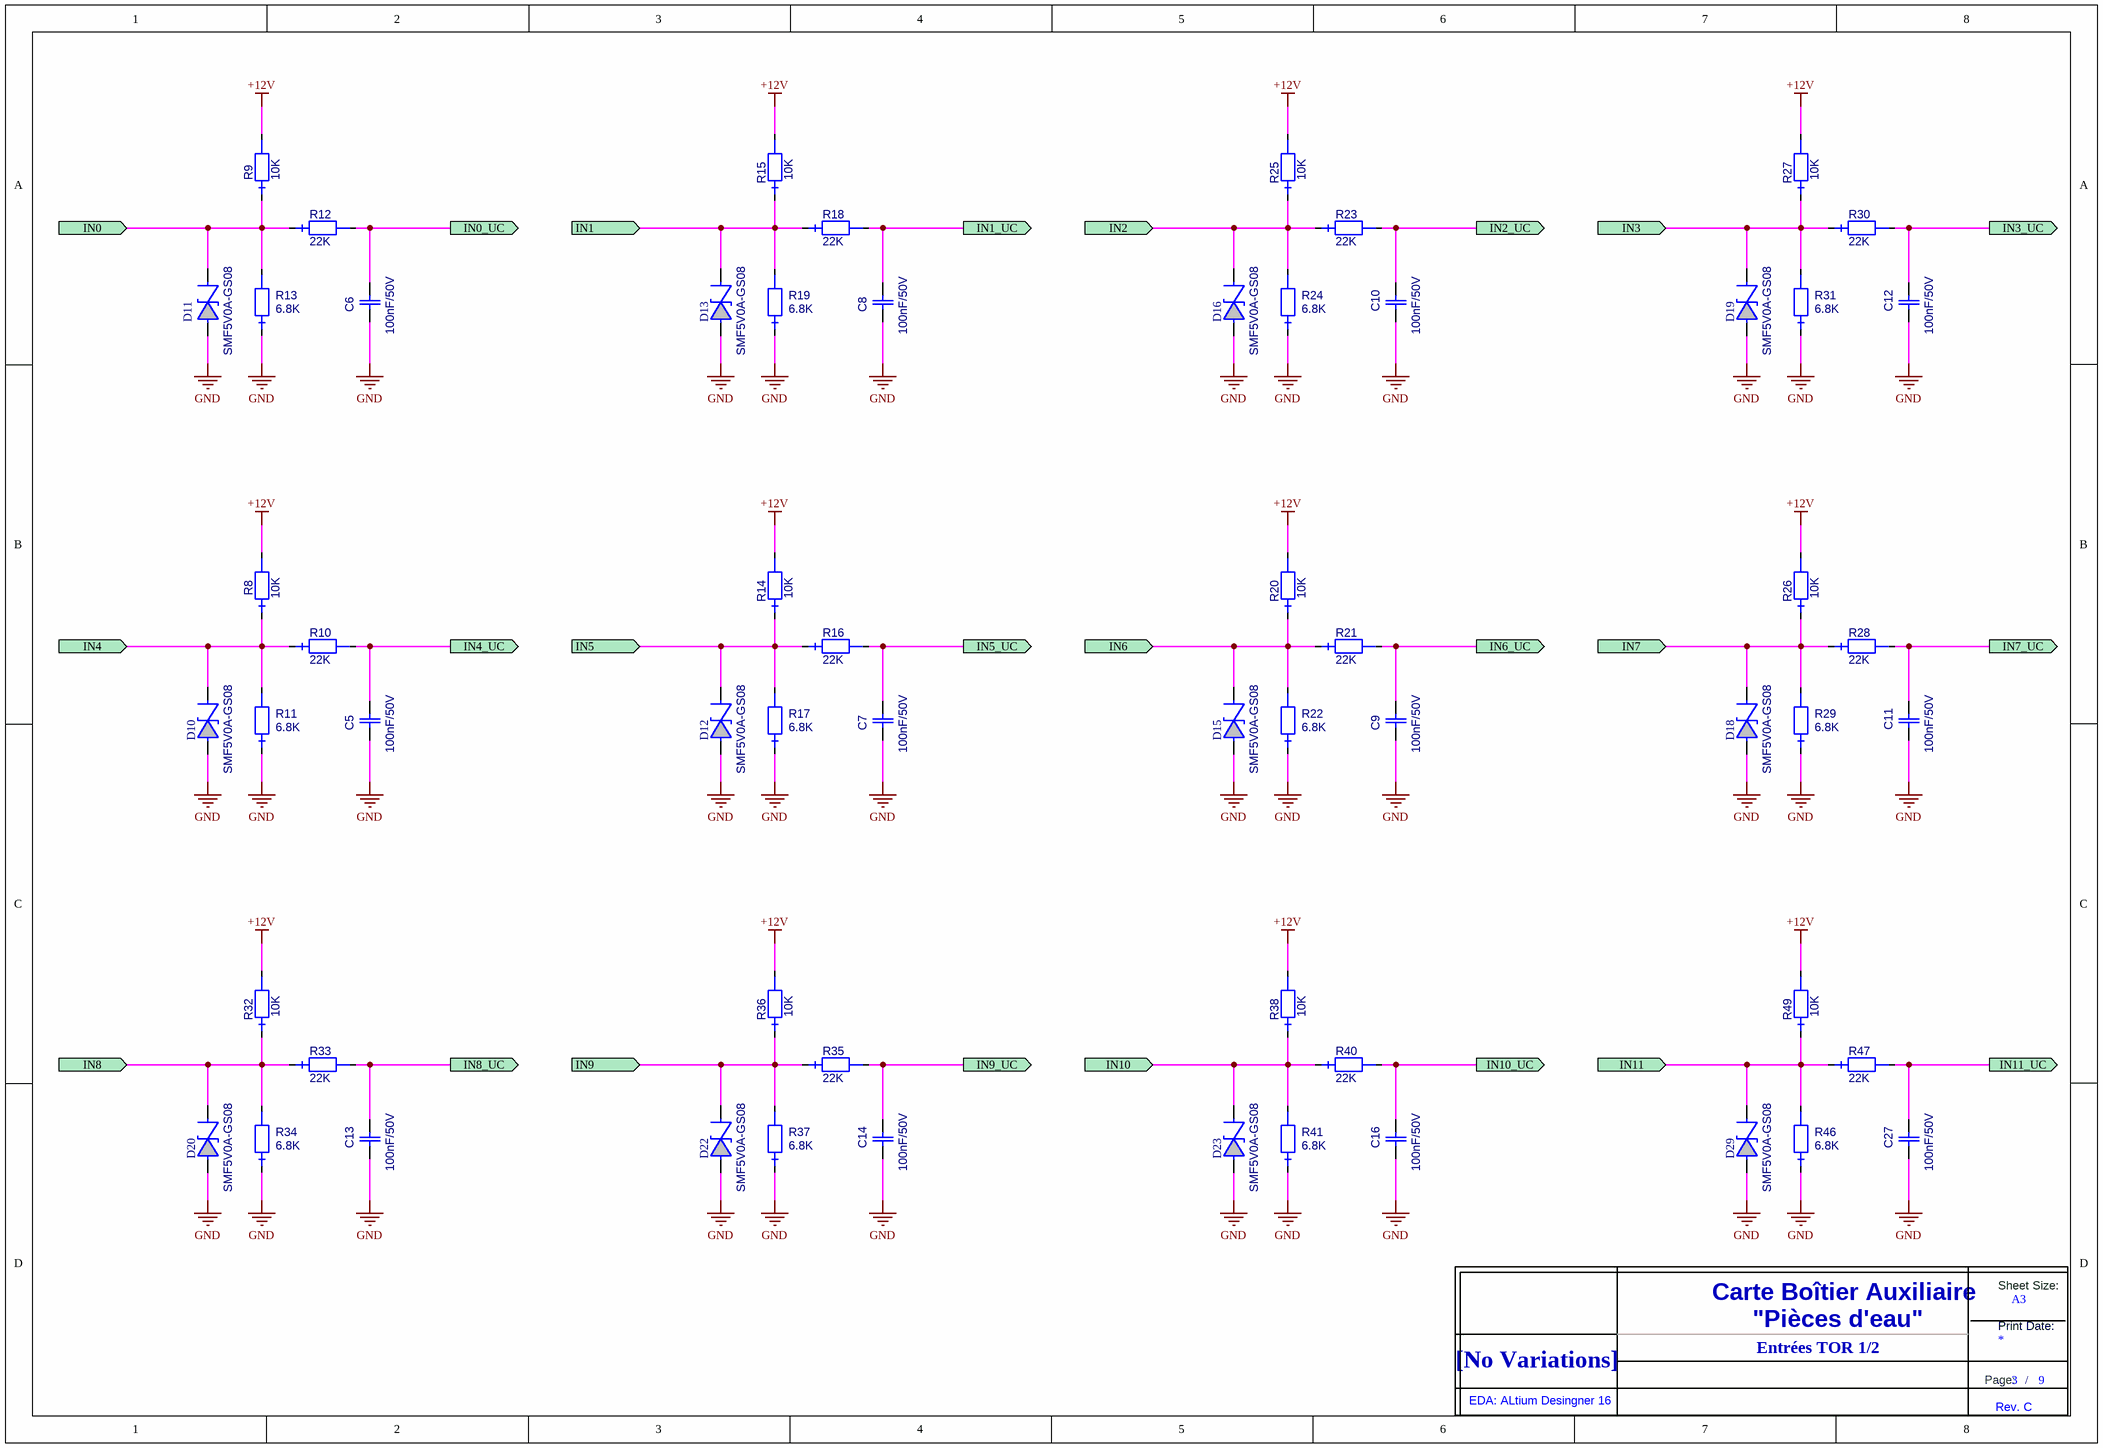
[diagram p3: SC941C_ETOR1.SchDoc]

### Parts
(Parts that share a designator on the sheet are numbered #1, #2 ... from top to bottom, then left to right.)
C5  value 100nF/50V  [0805_ReflowSoldering_CAP]  (hidden comment: C_0805_X7R_10%_100N-50V)
C6  value 100nF/50V  [0805_ReflowSoldering_CAP]  (hidden comment: C_0805_X7R_10%_100N-50V)
C7  value 100nF/50V  [0805_ReflowSoldering_CAP]  (hidden comment: C_0805_X7R_10%_100N-50V)
C8  value 100nF/50V  [0805_ReflowSoldering_CAP]  (hidden comment: C_0805_X7R_10%_100N-50V)
C9  value 100nF/50V  [0805_ReflowSoldering_CAP]  (hidden comment: C_0805_X7R_10%_100N-50V)
C10  value 100nF/50V  [0805_ReflowSoldering_CAP]  (hidden comment: C_0805_X7R_10%_100N-50V)
C11  value 100nF/50V  [0805_ReflowSoldering_CAP]  (hidden comment: C_0805_X7R_10%_100N-50V)
C12  value 100nF/50V  [0805_ReflowSoldering_CAP]  (hidden comment: C_0805_X7R_10%_100N-50V)
C13  value 100nF/50V  [0805_ReflowSoldering_CAP]  (hidden comment: C_0805_X7R_10%_100N-50V)
C14  value 100nF/50V  [0805_ReflowSoldering_CAP]  (hidden comment: C_0805_X7R_10%_100N-50V)
C16  value 100nF/50V  [0805_ReflowSoldering_CAP]  (hidden comment: C_0805_X7R_10%_100N-50V)
C27  value 100nF/50V  [0805_ReflowSoldering_CAP]  (hidden comment: C_0805_X7R_10%_100N-50V)
D10  SMF5V0A-GS08  [DO219AB-SMF-P_ReflowSoldering]
D11  SMF5V0A-GS08  [DO219AB-SMF-P_ReflowSoldering]
D12  SMF5V0A-GS08  [DO219AB-SMF-P_ReflowSoldering]
D13  SMF5V0A-GS08  [DO219AB-SMF-P_ReflowSoldering]
D15  SMF5V0A-GS08  [DO219AB-SMF-P_ReflowSoldering]
D16  SMF5V0A-GS08  [DO219AB-SMF-P_ReflowSoldering]
D18  SMF5V0A-GS08  [DO219AB-SMF-P_ReflowSoldering]
D19  SMF5V0A-GS08  [DO219AB-SMF-P_ReflowSoldering]
D20  SMF5V0A-GS08  [DO219AB-SMF-P_ReflowSoldering]
D22  SMF5V0A-GS08  [DO219AB-SMF-P_ReflowSoldering]
D23  SMF5V0A-GS08  [DO219AB-SMF-P_ReflowSoldering]
D29  SMF5V0A-GS08  [DO219AB-SMF-P_ReflowSoldering]
R8  value 10K  [0805_ReflowSoldering_RES]  (hidden comment: RES_0805_1%_100PPM_10K)
R9  value 10K  [0805_ReflowSoldering_RES]  (hidden comment: RES_0805_1%_100PPM_10K)
R10  value 22K  [0805_ReflowSoldering_RES]  (hidden comment: RES_0805_1%_100PPM_22K)
R11  value 6.8K  [0805_ReflowSoldering_RES]  (hidden comment: RES_0805_1%_100PPM_6.8K)
R12  value 22K  [0805_ReflowSoldering_RES]  (hidden comment: RES_0805_1%_100PPM_22K)
R13  value 6.8K  [0805_ReflowSoldering_RES]  (hidden comment: RES_0805_1%_100PPM_6.8K)
R14  value 10K  [0805_ReflowSoldering_RES]  (hidden comment: RES_0805_1%_100PPM_10K)
R15  value 10K  [0805_ReflowSoldering_RES]  (hidden comment: RES_0805_1%_100PPM_10K)
R16  value 22K  [0805_ReflowSoldering_RES]  (hidden comment: RES_0805_1%_100PPM_22K)
R17  value 6.8K  [0805_ReflowSoldering_RES]  (hidden comment: RES_0805_1%_100PPM_6.8K)
R18  value 22K  [0805_ReflowSoldering_RES]  (hidden comment: RES_0805_1%_100PPM_22K)
R19  value 6.8K  [0805_ReflowSoldering_RES]  (hidden comment: RES_0805_1%_100PPM_6.8K)
R20  value 10K  [0805_ReflowSoldering_RES]  (hidden comment: RES_0805_1%_100PPM_10K)
R21  value 22K  [0805_ReflowSoldering_RES]  (hidden comment: RES_0805_1%_100PPM_22K)
R22  value 6.8K  [0805_ReflowSoldering_RES]  (hidden comment: RES_0805_1%_100PPM_6.8K)
R23  value 22K  [0805_ReflowSoldering_RES]  (hidden comment: RES_0805_1%_100PPM_22K)
R24  value 6.8K  [0805_ReflowSoldering_RES]  (hidden comment: RES_0805_1%_100PPM_6.8K)
R25  value 10K  [0805_ReflowSoldering_RES]  (hidden comment: RES_0805_1%_100PPM_10K)
R26  value 10K  [0805_ReflowSoldering_RES]  (hidden comment: RES_0805_1%_100PPM_10K)
R27  value 10K  [0805_ReflowSoldering_RES]  (hidden comment: RES_0805_1%_100PPM_10K)
R28  value 22K  [0805_ReflowSoldering_RES]  (hidden comment: RES_0805_1%_100PPM_22K)
R29  value 6.8K  [0805_ReflowSoldering_RES]  (hidden comment: RES_0805_1%_100PPM_6.8K)
R30  value 22K  [0805_ReflowSoldering_RES]  (hidden comment: RES_0805_1%_100PPM_22K)
R31  value 6.8K  [0805_ReflowSoldering_RES]  (hidden comment: RES_0805_1%_100PPM_6.8K)
R32  value 10K  [0805_ReflowSoldering_RES]  (hidden comment: RES_0805_1%_100PPM_10K)
R33  value 22K  [0805_ReflowSoldering_RES]  (hidden comment: RES_0805_1%_100PPM_22K)
R34  value 6.8K  [0805_ReflowSoldering_RES]  (hidden comment: RES_0805_1%_100PPM_6.8K)
R35  value 22K  [0805_ReflowSoldering_RES]  (hidden comment: RES_0805_1%_100PPM_22K)
R36  value 10K  [0805_ReflowSoldering_RES]  (hidden comment: RES_0805_1%_100PPM_10K)
R37  value 6.8K  [0805_ReflowSoldering_RES]  (hidden comment: RES_0805_1%_100PPM_6.8K)
R38  value 10K  [0805_ReflowSoldering_RES]  (hidden comment: RES_0805_1%_100PPM_10K)
R40  value 22K  [0805_ReflowSoldering_RES]  (hidden comment: RES_0805_1%_100PPM_22K)
R41  value 6.8K  [0805_ReflowSoldering_RES]  (hidden comment: RES_0805_1%_100PPM_6.8K)
R46  value 6.8K  [0805_ReflowSoldering_RES]  (hidden comment: RES_0805_1%_100PPM_6.8K)
R47  value 22K  [0805_ReflowSoldering_RES]  (hidden comment: RES_0805_1%_100PPM_22K)
R49  value 10K  [0805_ReflowSoldering_RES]  (hidden comment: RES_0805_1%_100PPM_10K)
Title_new#3  DNI  (value not drawn)  (graphical)

### Ports
IN0 (in), IN0_UC (out), IN1 (in), IN1_UC (out), IN2 (in), IN2_UC (out), IN3 (in), IN3_UC (out), IN4 (in), IN4_UC (out), IN5 (in), IN5_UC (out), IN6 (in), IN6_UC (out), IN7 (in), IN7_UC (out), IN8 (in), IN8_UC (out), IN9 (in), IN9_UC (out), IN10 (in), IN10_UC (out), IN11 (in), IN11_UC (out)

### Nets
+12V: R8.2 R9.2 R14.2 R15.2 R20.2 R25.2 R26.2 R27.2 R32.2 R36.2 R38.2 R49.2
GND: C5.1 C6.1 C7.1 C8.1 C9.1 C10.1 C11.1 C12.1 C13.1 C14.1 C16.1 C27.1 D10.A D11.A D12.A D13.A D15.A D16.A D18.A D19.A D20.A D22.A D23.A D29.A R11.1 R13.1 R17.1 R19.1 R22.1 R24.1 R29.1 R31.1 R34.1 R37.1 R41.1 R46.1
IN0: D11.K R9.1 R12.1 R13.2 ; port IN0
IN0_UC: C6.2 R12.2 ; port IN0_UC
IN1: D13.K R15.1 R18.1 R19.2 ; port IN1
IN1_UC: C8.2 R18.2 ; port IN1_UC
IN2: D16.K R23.1 R24.2 R25.1 ; port IN2
IN2_UC: C10.2 R23.2 ; port IN2_UC
IN3: D19.K R27.1 R30.1 R31.2 ; port IN3
IN3_UC: C12.2 R30.2 ; port IN3_UC
IN4: D10.K R8.1 R10.1 R11.2 ; port IN4
IN4_UC: C5.2 R10.2 ; port IN4_UC
IN5: D12.K R14.1 R16.1 R17.2 ; port IN5
IN5_UC: C7.2 R16.2 ; port IN5_UC
IN6: D15.K R20.1 R21.1 R22.2 ; port IN6
IN6_UC: C9.2 R21.2 ; port IN6_UC
IN7: D18.K R26.1 R28.1 R29.2 ; port IN7
IN7_UC: C11.2 R28.2 ; port IN7_UC
IN8: D20.K R32.1 R33.1 R34.2 ; port IN8
IN8_UC: C13.2 R33.2 ; port IN8_UC
IN9: D22.K R35.1 R36.1 R37.2 ; port IN9
IN9_UC: C14.2 R35.2 ; port IN9_UC
IN10: D23.K R38.1 R40.1 R41.2 ; port IN10
IN10_UC: C16.2 R40.2 ; port IN10_UC
IN11: D29.K R46.2 R47.1 R49.1 ; port IN11
IN11_UC: C27.2 R47.2 ; port IN11_UC

### Notes on the sheet
- Entrées TOR 1/2
- (in symbol Title_new) Sheet Size:; Carte Boîtier Auxiliaire; A3; "Pièces d'eau"; Print Date:; [No Variations]; Page:; /; EDA: ALtium Desingner 16; Rev. C

### Library data of the parts
C5-C14 C16 C27 = C_0805_X7R_10%_100N-50V: as C1 on sheet SC941C_Coeur; ComponentLink1URL: o:\_Documentation\Datasheets\BC_Components\Condo_CMS_NPO-X7R-Y5V.pdf; ComponentLink2URL: o:\_Documentation\Datasheets\_BOITIERS\PASSIF_CMS\RC_0805_(2x1,25)_(Schneider).PDF; Config: *; ComponentLink1Description: Datasheet; ComponentLink2Description: Datasheet Boitier; Supplier 1: Farnell; Supplier Part Number 1: 499687
D10-D13 D15 D16 D18-D20 D22 D23 D29 = SMF5V0A-GS08: as D1 on sheet SC941C_Coeur; Verification: *; Ref Fab: SMF5V0A-GS08; ComponentLink1URL: o:\_Documentation\Datasheets\Vishay\SMF5V0A~51A.pdf; ComponentLink2URL: o:\_Documentation\Datasheets\_BOITIERS\; Config: *; ComponentLink1Description: Datasheet; ComponentLink2Description: Datasheet Boitier; Value: SMF5V0A-GS08; Supplier 1: Farnell; Supplier 2: Mouser; Supplier Part Number 1: 1617696; Supplier Part Number 2: 78-SMF5V0A
R8 R9 R14 R15 R20 R25-R27 R32 R36 R38 R49 = RES_0805_1%_100PPM_10K: as R5 on sheet SC941C_Coeur; Verification: *; ComponentLink1URL: o:\_Documentation\Datasheets\BC_Components\Resistances_ThickFilmFlatChip_0402-0603-0805-1206.pdf; ComponentLink2URL: o:\_Documentation\Datasheets\_BOITIERS\PASSIF_CMS\RC_0805_(2x1,25)_(Schneider).PDF; Config: *; ComponentLink1Description: Datasheet; ComponentLink2Description: Datasheet Boitier; Supplier 1: Farnell; Supplier Part Number 1: 9237755
R10 R12 R16 R18 R21 R23 R28 R30 R33 R35 R40 R47 = RES_0805_1%_100PPM_22K: Résistance CMS 0805, 0.125W, 1%, 100ppm, 150V; Creation: LJ (06/02/09); Reference: 000137/00; Boitier: 0805; Remarque: {Remarque}; Fabricant: Yageo; Ref Fab: RC0805FR-0722KL; Coeff: 1; Verification: *; ComponentLink1URL: o:\_Documentation\Datasheets\BC_Components\Resistances_ThickFilmFlatChip_0402-0603-0805-1206.pdf; ComponentLink2URL: o:\_Documentation\Datasheets\_BOITIERS\PASSIF_CMS\RC_0805_(2x1,25)_(Schneider).PDF; Config: *; ComponentLink1Description: Datasheet; ComponentLink2Description: Datasheet Boitier; Supplier 1: Farnell; Supplier Part Number 1: 9237798; Supplier 2: Mouser; Supplier Part Number 2: 603-RC0805FR-0722KL
R11 R13 R17 R19 R22 R24 R29 R31 R34 R37 R41 R46 = RES_0805_1%_100PPM_6.8K: Résistance CMS 0805, 0.125W, 1%, 100ppm, 150V; Creation: LJ (06/02/09); Reference: 000129/00; Boitier: 0805; Remarque: {Remarque}; Fabricant: Yageo; Ref Fab: RC0805FR-076K8L; Coeff: 1; Verification: *; ComponentLink1URL: o:\_Documentation\Datasheets\BC_Components\Resistances_ThickFilmFlatChip_0402-0603-0805-1206.pdf; ComponentLink2URL: o:\_Documentation\Datasheets\_BOITIERS\PASSIF_CMS\RC_0805_(2x1,25)_(Schneider).PDF; Config: *; ComponentLink1Description: Datasheet; ComponentLink2Description: Datasheet Boitier; Supplier 1: Farnell; Supplier Part Number 1: 9237739; Supplier 2: Mouser; Supplier Part Number 2: 603-RC0805FR-076K8L
Title_new#3 = Title_new

## Sheet SC941C_ETOR2.SchDoc: Entrées TOR 2/2
size 393 x 270 mm; CompanyName: Seccom; Address1: 521, rue du capt. François Garbit; Address2: 69440 Mornant; Address3: seccom@seccom.fr; Address4: www.seccom.fr; DocumentNumber: 4; SheetNumber: 4; SheetTotal: 9; PageSetup: Record=PageOptions|CenterHorizontal=True|CenterVertical=True|PrintScale=0.74|XCorrection=1.00|YCorrection=1.00|PrintKind=0|BorderSize=5000000|LeftOffset=0|BottomOffset=0|Orientation=2|PaperLength=1000|PaperWidth=1000|Scale=100|PaperSource=7|PrintQuality=-4|MediaType=1|DitherType=10|PaperKind=A4|PrintScaleMode=1
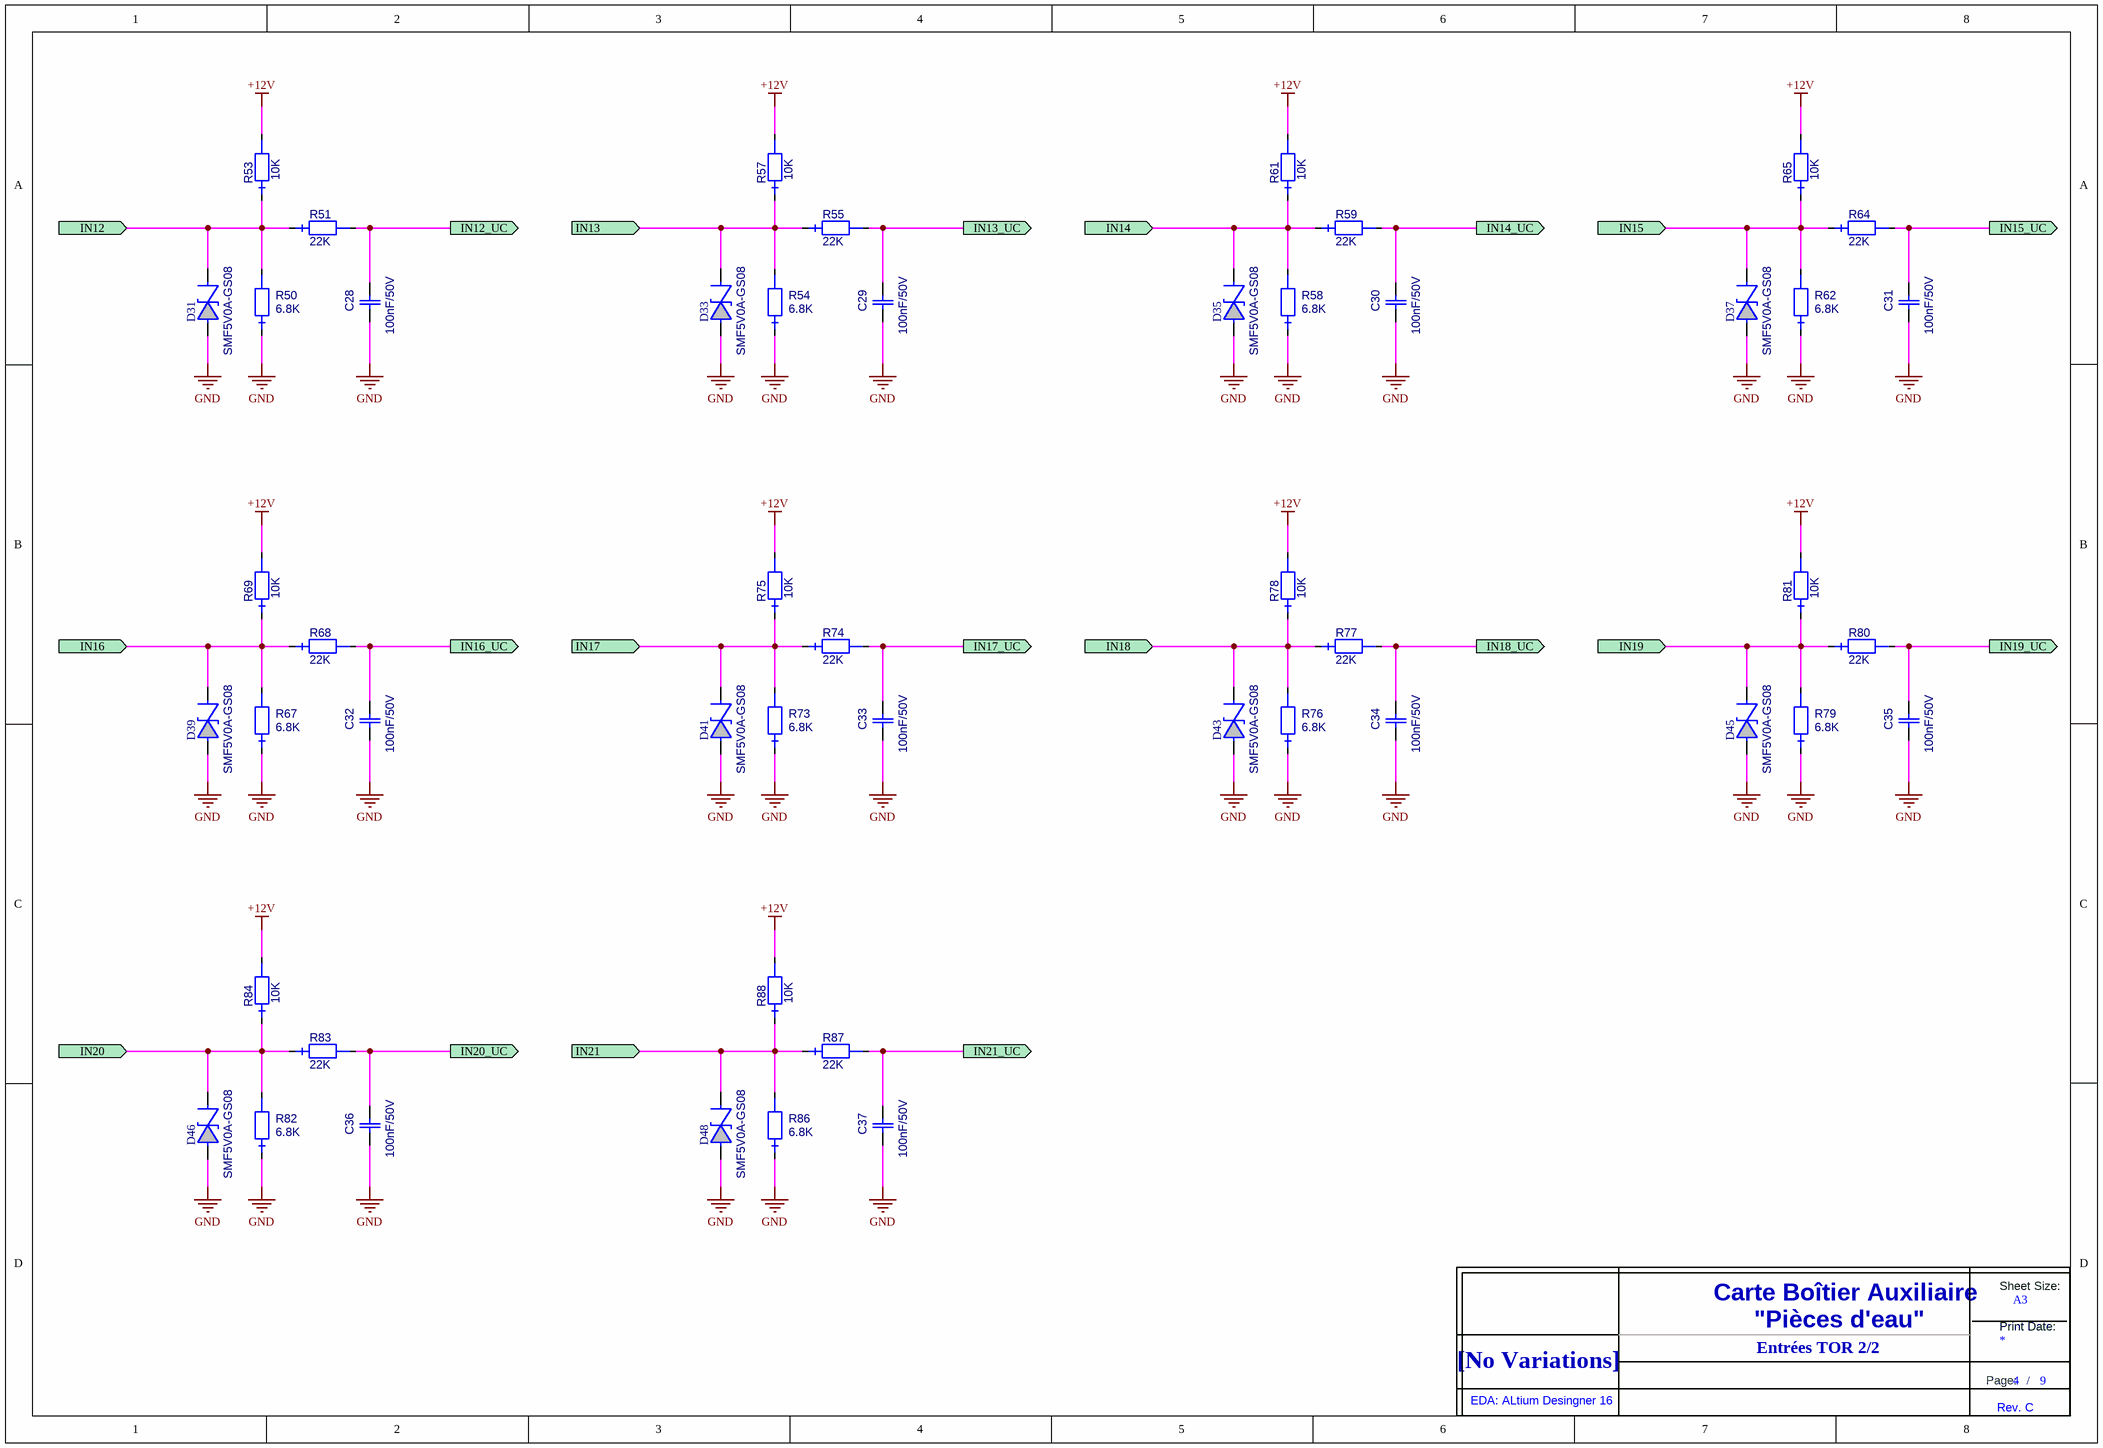
[diagram p4: SC941C_ETOR2.SchDoc]

### Parts
(Parts that share a designator on the sheet are numbered #1, #2 ... from top to bottom, then left to right.)
C28  value 100nF/50V  [0805_ReflowSoldering_CAP]  (hidden comment: C_0805_X7R_10%_100N-50V)
C29  value 100nF/50V  [0805_ReflowSoldering_CAP]  (hidden comment: C_0805_X7R_10%_100N-50V)
C30  value 100nF/50V  [0805_ReflowSoldering_CAP]  (hidden comment: C_0805_X7R_10%_100N-50V)
C31  value 100nF/50V  [0805_ReflowSoldering_CAP]  (hidden comment: C_0805_X7R_10%_100N-50V)
C32  value 100nF/50V  [0805_ReflowSoldering_CAP]  (hidden comment: C_0805_X7R_10%_100N-50V)
C33  value 100nF/50V  [0805_ReflowSoldering_CAP]  (hidden comment: C_0805_X7R_10%_100N-50V)
C34  value 100nF/50V  [0805_ReflowSoldering_CAP]  (hidden comment: C_0805_X7R_10%_100N-50V)
C35  value 100nF/50V  [0805_ReflowSoldering_CAP]  (hidden comment: C_0805_X7R_10%_100N-50V)
C36  value 100nF/50V  [0805_ReflowSoldering_CAP]  (hidden comment: C_0805_X7R_10%_100N-50V)
C37  value 100nF/50V  [0805_ReflowSoldering_CAP]  (hidden comment: C_0805_X7R_10%_100N-50V)
D31  SMF5V0A-GS08  [DO219AB-SMF-P_ReflowSoldering]
D33  SMF5V0A-GS08  [DO219AB-SMF-P_ReflowSoldering]
D35  SMF5V0A-GS08  [DO219AB-SMF-P_ReflowSoldering]
D37  SMF5V0A-GS08  [DO219AB-SMF-P_ReflowSoldering]
D39  SMF5V0A-GS08  [DO219AB-SMF-P_ReflowSoldering]
D41  SMF5V0A-GS08  [DO219AB-SMF-P_ReflowSoldering]
D43  SMF5V0A-GS08  [DO219AB-SMF-P_ReflowSoldering]
D45  SMF5V0A-GS08  [DO219AB-SMF-P_ReflowSoldering]
D46  SMF5V0A-GS08  [DO219AB-SMF-P_ReflowSoldering]
D48  SMF5V0A-GS08  [DO219AB-SMF-P_ReflowSoldering]
R50  value 6.8K  [0805_ReflowSoldering_RES]  (hidden comment: RES_0805_1%_100PPM_6.8K)
R51  value 22K  [0805_ReflowSoldering_RES]  (hidden comment: RES_0805_1%_100PPM_22K)
R53  value 10K  [0805_ReflowSoldering_RES]  (hidden comment: RES_0805_1%_100PPM_10K)
R54  value 6.8K  [0805_ReflowSoldering_RES]  (hidden comment: RES_0805_1%_100PPM_6.8K)
R55  value 22K  [0805_ReflowSoldering_RES]  (hidden comment: RES_0805_1%_100PPM_22K)
R57  value 10K  [0805_ReflowSoldering_RES]  (hidden comment: RES_0805_1%_100PPM_10K)
R58  value 6.8K  [0805_ReflowSoldering_RES]  (hidden comment: RES_0805_1%_100PPM_6.8K)
R59  value 22K  [0805_ReflowSoldering_RES]  (hidden comment: RES_0805_1%_100PPM_22K)
R61  value 10K  [0805_ReflowSoldering_RES]  (hidden comment: RES_0805_1%_100PPM_10K)
R62  value 6.8K  [0805_ReflowSoldering_RES]  (hidden comment: RES_0805_1%_100PPM_6.8K)
R64  value 22K  [0805_ReflowSoldering_RES]  (hidden comment: RES_0805_1%_100PPM_22K)
R65  value 10K  [0805_ReflowSoldering_RES]  (hidden comment: RES_0805_1%_100PPM_10K)
R67  value 6.8K  [0805_ReflowSoldering_RES]  (hidden comment: RES_0805_1%_100PPM_6.8K)
R68  value 22K  [0805_ReflowSoldering_RES]  (hidden comment: RES_0805_1%_100PPM_22K)
R69  value 10K  [0805_ReflowSoldering_RES]  (hidden comment: RES_0805_1%_100PPM_10K)
R73  value 6.8K  [0805_ReflowSoldering_RES]  (hidden comment: RES_0805_1%_100PPM_6.8K)
R74  value 22K  [0805_ReflowSoldering_RES]  (hidden comment: RES_0805_1%_100PPM_22K)
R75  value 10K  [0805_ReflowSoldering_RES]  (hidden comment: RES_0805_1%_100PPM_10K)
R76  value 6.8K  [0805_ReflowSoldering_RES]  (hidden comment: RES_0805_1%_100PPM_6.8K)
R77  value 22K  [0805_ReflowSoldering_RES]  (hidden comment: RES_0805_1%_100PPM_22K)
R78  value 10K  [0805_ReflowSoldering_RES]  (hidden comment: RES_0805_1%_100PPM_10K)
R79  value 6.8K  [0805_ReflowSoldering_RES]  (hidden comment: RES_0805_1%_100PPM_6.8K)
R80  value 22K  [0805_ReflowSoldering_RES]  (hidden comment: RES_0805_1%_100PPM_22K)
R81  value 10K  [0805_ReflowSoldering_RES]  (hidden comment: RES_0805_1%_100PPM_10K)
R82  value 6.8K  [0805_ReflowSoldering_RES]  (hidden comment: RES_0805_1%_100PPM_6.8K)
R83  value 22K  [0805_ReflowSoldering_RES]  (hidden comment: RES_0805_1%_100PPM_22K)
R84  value 10K  [0805_ReflowSoldering_RES]  (hidden comment: RES_0805_1%_100PPM_10K)
R86  value 6.8K  [0805_ReflowSoldering_RES]  (hidden comment: RES_0805_1%_100PPM_6.8K)
R87  value 22K  [0805_ReflowSoldering_RES]  (hidden comment: RES_0805_1%_100PPM_22K)
R88  value 10K  [0805_ReflowSoldering_RES]  (hidden comment: RES_0805_1%_100PPM_10K)
Title_new#4  DNI  (value not drawn)  (graphical)

### Ports
IN12 (in), IN12_UC (out), IN13 (in), IN13_UC (out), IN14 (in), IN14_UC (out), IN15 (in), IN15_UC (out), IN16 (in), IN16_UC (out), IN17 (in), IN17_UC (out), IN18 (in), IN18_UC (out), IN19 (in), IN19_UC (out), IN20 (in), IN20_UC (out), IN21 (in), IN21_UC (out)

### Nets
+12V: R53.2 R57.2 R61.2 R65.2 R69.2 R75.2 R78.2 R81.2 R84.2 R88.2
GND: C28.1 C29.1 C30.1 C31.1 C32.1 C33.1 C34.1 C35.1 C36.1 C37.1 D31.A D33.A D35.A D37.A D39.A D41.A D43.A D45.A D46.A D48.A R50.1 R54.1 R58.1 R62.1 R67.1 R73.1 R76.1 R79.1 R82.1 R86.1
IN12: D31.K R50.2 R51.1 R53.1 ; port IN12
IN12_UC: C28.2 R51.2 ; port IN12_UC
IN13: D33.K R54.2 R55.1 R57.1 ; port IN13
IN13_UC: C29.2 R55.2 ; port IN13_UC
IN14: D35.K R58.2 R59.1 R61.1 ; port IN14
IN14_UC: C30.2 R59.2 ; port IN14_UC
IN15: D37.K R62.2 R64.1 R65.1 ; port IN15
IN15_UC: C31.2 R64.2 ; port IN15_UC
IN16: D39.K R67.2 R68.1 R69.1 ; port IN16
IN16_UC: C32.2 R68.2 ; port IN16_UC
IN17: D41.K R73.2 R74.1 R75.1 ; port IN17
IN17_UC: C33.2 R74.2 ; port IN17_UC
IN18: D43.K R76.2 R77.1 R78.1 ; port IN18
IN18_UC: C34.2 R77.2 ; port IN18_UC
IN19: D45.K R79.2 R80.1 R81.1 ; port IN19
IN19_UC: C35.2 R80.2 ; port IN19_UC
IN20: D46.K R82.2 R83.1 R84.1 ; port IN20
IN20_UC: C36.2 R83.2 ; port IN20_UC
IN21: D48.K R86.2 R87.1 R88.1 ; port IN21
IN21_UC: C37.2 R87.2 ; port IN21_UC

### Notes on the sheet
- Entrées TOR 2/2
- (in symbol Title_new) Sheet Size:; Carte Boîtier Auxiliaire; A3; "Pièces d'eau"; Print Date:; [No Variations]; Page:; /; EDA: ALtium Desingner 16; Rev. C

### Library data of the parts
C28-C37 = C_0805_X7R_10%_100N-50V: as C1 on sheet SC941C_Coeur; ComponentLink1URL: o:\_Documentation\Datasheets\BC_Components\Condo_CMS_NPO-X7R-Y5V.pdf; ComponentLink2URL: o:\_Documentation\Datasheets\_BOITIERS\PASSIF_CMS\RC_0805_(2x1,25)_(Schneider).PDF; Config: *; ComponentLink1Description: Datasheet; ComponentLink2Description: Datasheet Boitier; Supplier 1: Farnell; Supplier Part Number 1: 499687
D31 D33 D35 D37 D39 D41 D43 D45 D46 D48 = SMF5V0A-GS08: as D1 on sheet SC941C_Coeur; Verification: *; Ref Fab: SMF5V0A-GS08; ComponentLink1URL: o:\_Documentation\Datasheets\Vishay\SMF5V0A~51A.pdf; ComponentLink2URL: o:\_Documentation\Datasheets\_BOITIERS\; Config: *; ComponentLink1Description: Datasheet; ComponentLink2Description: Datasheet Boitier; Value: SMF5V0A-GS08; Supplier 1: Farnell; Supplier 2: Mouser; Supplier Part Number 1: 1617696; Supplier Part Number 2: 78-SMF5V0A
R50 R54 R58 R62 R67 R73 R76 R79 R82 R86 = RES_0805_1%_100PPM_6.8K: as R11 on sheet SC941C_ETOR1; Verification: *; ComponentLink1URL: o:\_Documentation\Datasheets\BC_Components\Resistances_ThickFilmFlatChip_0402-0603-0805-1206.pdf; ComponentLink2URL: o:\_Documentation\Datasheets\_BOITIERS\PASSIF_CMS\RC_0805_(2x1,25)_(Schneider).PDF; Config: *; ComponentLink1Description: Datasheet; ComponentLink2Description: Datasheet Boitier; Supplier 1: Farnell; Supplier Part Number 1: 9237739; Supplier 2: Mouser; Supplier Part Number 2: 603-RC0805FR-076K8L
R51 R55 R59 R64 R68 R74 R77 R80 R83 R87 = RES_0805_1%_100PPM_22K: as R10 on sheet SC941C_ETOR1; Verification: *; ComponentLink1URL: o:\_Documentation\Datasheets\BC_Components\Resistances_ThickFilmFlatChip_0402-0603-0805-1206.pdf; ComponentLink2URL: o:\_Documentation\Datasheets\_BOITIERS\PASSIF_CMS\RC_0805_(2x1,25)_(Schneider).PDF; Config: *; ComponentLink1Description: Datasheet; ComponentLink2Description: Datasheet Boitier; Supplier 1: Farnell; Supplier Part Number 1: 9237798; Supplier 2: Mouser; Supplier Part Number 2: 603-RC0805FR-0722KL
R53 R57 R61 R65 R69 R75 R78 R81 R84 R88 = RES_0805_1%_100PPM_10K: as R5 on sheet SC941C_Coeur; Verification: *; ComponentLink1URL: o:\_Documentation\Datasheets\BC_Components\Resistances_ThickFilmFlatChip_0402-0603-0805-1206.pdf; ComponentLink2URL: o:\_Documentation\Datasheets\_BOITIERS\PASSIF_CMS\RC_0805_(2x1,25)_(Schneider).PDF; Config: *; ComponentLink1Description: Datasheet; ComponentLink2Description: Datasheet Boitier; Supplier 1: Farnell; Supplier Part Number 1: 9237755
Title_new#4 = Title_new